# EAGLE design edges_v20 (EAGLE 7.7.0)

## Sheet 1 of 3
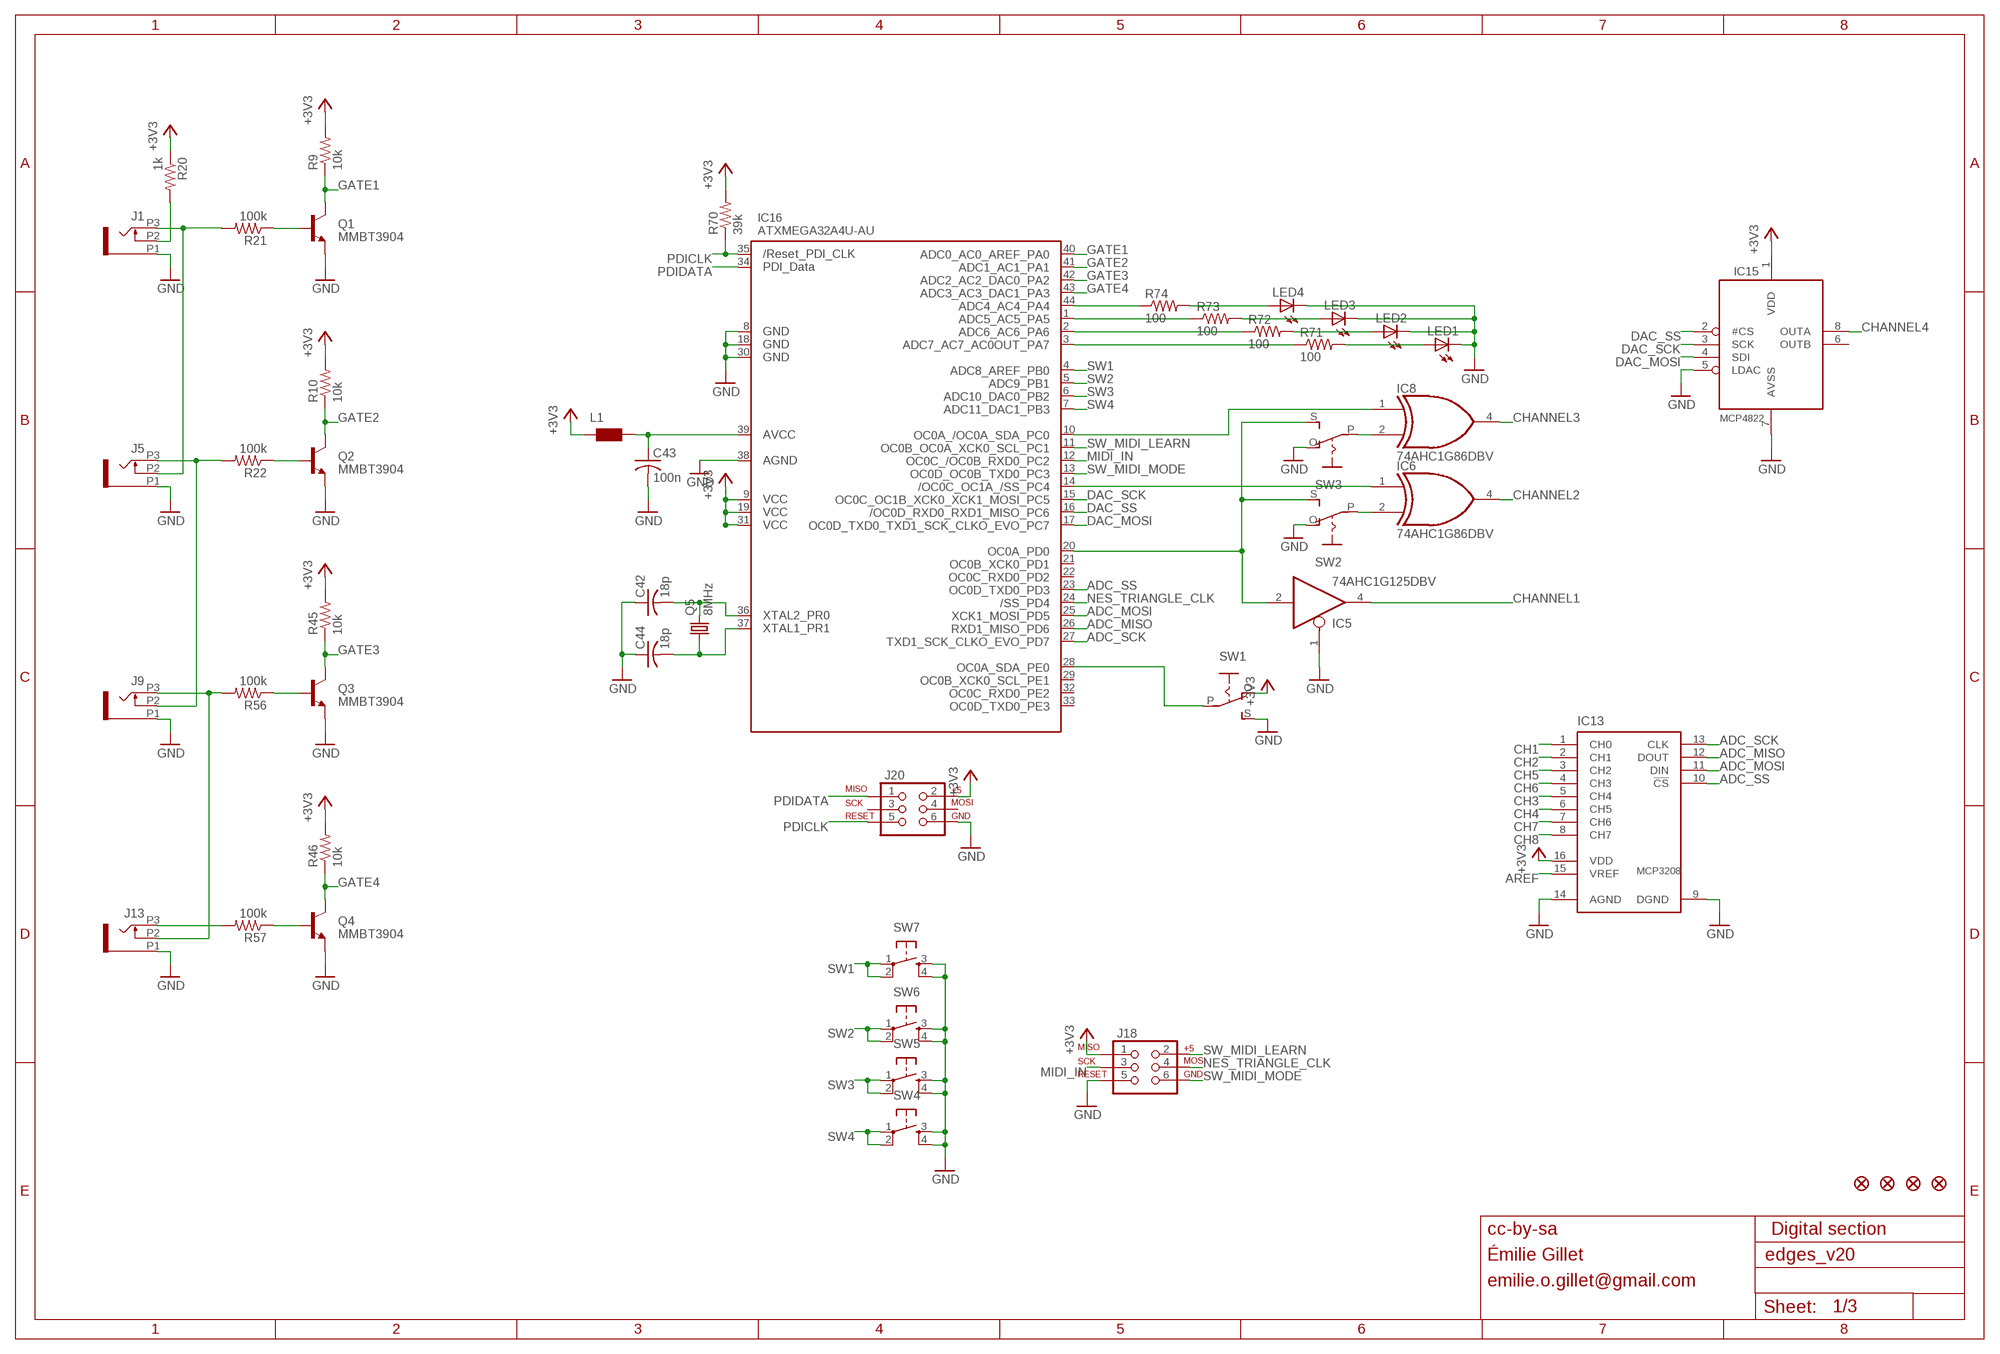
[diagram p0: schematic, sheet 1]

### Parts
C42  18p  C-USC0603  [C0603]
C43  100n  C-USC0603  [C0603]
C44  18p  C-USC0603  [C0603]
IC5  74AHC1G125DBV  [SOT23-5]
IC6  74AHC1G86DBV  [SOT23-5]
IC8  74AHC1G86DBV  [SOT23-5]
IC13  MCP3208  [SO16]
IC15  MCP4822  MCP4822SO08  [SO08]
IC16  ATXMEGA32A4U-AU  AVR_XMEGA_A4_44A  [TQFP44]
J1  PJ301_THONKICONN6  [WQP_PJ_301M6]
J5  PJ301_THONKICONN6  [WQP_PJ_301M6]
J9  PJ301_THONKICONN6  [WQP_PJ_301M6]
J13  PJ301_THONKICONN6  [WQP_PJ_301M6]
J18  AVR_SPI_PRG_6PTH  [2X3]
J20  AVR_SPI_PRG_6PTH  [2X3]
JP1  FIDUCIAL1X2  [FIDUCIAL-1X2]
JP2  FIDUCIAL1X2  [FIDUCIAL-1X2]
JP3  FIDUCIAL1X2  [FIDUCIAL-1X2]
JP4  FIDUCIAL1X2  [FIDUCIAL-1X2]
L1  WE-CBF_0603  [0603]
LED1  LED3MM  [LED3MM]
LED2  LED3MM  [LED3MM]
LED3  LED3MM  [LED3MM]
LED4  LED3MM  [LED3MM]
Q1  MMBT3904  MMBT3904LT1-NPN-SOT23-BEC  [SOT23-BEC]
Q2  MMBT3904  MMBT3904LT1-NPN-SOT23-BEC  [SOT23-BEC]
Q3  MMBT3904  MMBT3904LT1-NPN-SOT23-BEC  [SOT23-BEC]
Q4  MMBT3904  MMBT3904LT1-NPN-SOT23-BEC  [SOT23-BEC]
Q5  8MHz  CRYSTALHC49U70  [HC49U70]
R9  10k  R-US_R0603  [R0603]
R10  10k  R-US_R0603  [R0603]
R20  1k  R-US_R0603  [R0603]
R21  100k  R-US_R0603  [R0603]
R22  100k  R-US_R0603  [R0603]
R45  10k  R-US_R0603  [R0603]
R46  10k  R-US_R0603  [R0603]
R56  100k  R-US_R0603  [R0603]
R57  100k  R-US_R0603  [R0603]
R70  39k  R-US_R0603  [R0603]
R71  100  R-US_R0603  [R0603]
R72  100  R-US_R0603  [R0603]
R73  100  R-US_R0603  [R0603]
R74  100  R-US_R0603  [R0603]
SW1  S-ON-ONSMALL_SLIDE  [ES_100SP1T6B11M2QEH_SMALL]
SW2  S-ON-ONSMALL_SLIDE  [ES_100SP1T6B11M2QEH_SMALL]
SW3  S-ON-ONSMALL_SLIDE  [ES_100SP1T6B11M2QEH_SMALL]
SW4  TAC_SWITCHPTH  [TACTILE-PTH]
SW5  TAC_SWITCHPTH  [TACTILE-PTH]
SW6  TAC_SWITCHPTH  [TACTILE-PTH]
SW7  TAC_SWITCHPTH  [TACTILE-PTH]

### Nets
+3V3: IC13.16(VDD) IC15.1(VDD) IC16.9(VCC1) IC16.19(VCC2) IC16.31(VCC3) J18.1 J20.2 L1.1 R9.2 R10.2 R20.1 R45.2 R46.2 R70.2 SW1.O ; also sheet 3
ADC_MISO: IC13.12(DOUT) IC16.26(PD6)
ADC_MOSI: IC13.11(DIN) IC16.25(PD5)
ADC_SCK: IC13.13(CLK) IC16.27(PD7)
ADC_SS: IC13.10(!CS) IC16.23(PD3)
AREF: IC13.15(VREF) ; also sheet 3
CH1: IC13.1(CH0) ; also sheet 2
CH2: IC13.2(CH1) ; also sheet 2
CH3: IC13.5(CH4) ; also sheet 2
CH4: IC13.6(CH5) ; also sheet 2
CH5: IC13.3(CH2) ; also sheet 2
CH6: IC13.4(CH3) ; also sheet 2
CH7: IC13.7(CH6) ; also sheet 2
CH8: IC13.8(CH7) ; also sheet 2
CHANNEL1: IC5.4(O) ; also sheet 2
CHANNEL2: IC6.4(O) ; also sheet 2
CHANNEL3: IC8.4(O) ; also sheet 2
CHANNEL4: IC15.8(OUTA) ; also sheet 2
DAC_MOSI: IC15.4(SDI) IC16.17(PC7)
DAC_SCK: IC15.3(SCK) IC16.15(PC5)
DAC_SS: IC15.2(#CS) IC16.16(PC6)
GATE1: IC16.40(PA0) Q1.C R9.1
GATE1_IN: J1.P3 J5.P2 R21.2
GATE1_LED: LED4.A R74.2
GATE2: IC16.41(PA1) Q2.C R10.1
GATE2_IN: J5.P3 J9.P2 R22.2
GATE2_LED: LED3.A R73.2
GATE3: IC16.42(PA2) Q3.C R45.1
GATE3_IN: J9.P3 J13.P2 R56.2
GATE3_LED: LED2.A R72.2
GATE4: IC16.43(PA3) Q4.C R46.1
GATE4_IN: J13.P3 R57.2
GATE4_LED: LED1.A R71.2
GND: C42.1 C43.2 C44.1 IC5.1(OE) IC13.9(DGND) IC13.14(AGND) IC15.5(LDAC) IC15.7(AVSS) IC16.8(GND1) IC16.18(GND2) IC16.30(GND3) IC16.38(AGND) J1.P1 J5.P1 J9.P1 J13.P1 J18.5 J20.6 LED1.K(C) LED2.K(C) LED3.K(C) LED4.K(C) Q1.E Q2.E Q3.E Q4.E SW1.S SW2.O SW3.O SW4.3 SW4.4 SW5.3 SW5.4 SW6.3 SW6.4 SW7.3 SW7.4 ; also sheet 2,3
MIDI_IN: IC16.12(PC2) J18.3
N$1: Q1.B R21.1
N$2: Q2.B R22.1
N$3: Q3.B R56.1
N$5: IC16.44(PA4) R74.1
N$6: IC16.1(PA5) R73.1
N$7: IC16.2(PA6) R72.1
N$8: IC16.3(PA7) R71.1
N$12: J1.P2 R20.2
N$19: IC6.1(I0) IC16.14(PC4)
N$21: IC8.2(I1) SW3.P
N$24: IC6.2(I1) SW2.P
N$39: C43.1 IC16.39(AVCC) L1.2
N$41: IC8.1(I0) IC16.10(PC0)
N$48: IC5.2(I) IC16.20(PD0) SW2.S SW3.S
N$82: C44.2 IC16.37(PR1) Q5.1
N$83: C42.2 IC16.36(PR0) Q5.2
N$40000: Q4.B R57.1
NES_TRIANGLE_CLK: IC16.24(PD4) J18.4
PDICLK: IC16.35(RESET) J20.5 R70.1
PDIDATA: IC16.34(PDI_DATA) J20.1
SW1: IC16.4(PB0) SW7.1 SW7.2
SW2: IC16.5(PB1) SW6.1 SW6.2
SW3: IC16.6(PB2) SW5.1 SW5.2
SW4: IC16.7(PB3) SW4.1 SW4.2
SW_MIDI_LEARN: IC16.11(PC1) J18.2
SW_MIDI_MODE: IC16.13(PC3) J18.6
SYNC_SWITCH: IC16.28(PE0) SW1.P
Unconnected: IC15.6(OUTB) IC16.21(PD1) IC16.22(PD2) IC16.29(PE1) IC16.32(PE2) IC16.33(PE3) J20.3 J20.4

### Notes on the sheet
- cc-by-sa | Digital section
- Émilie Gillet
- emilie.o.gillet@gmail.com

## Sheet 2 of 3
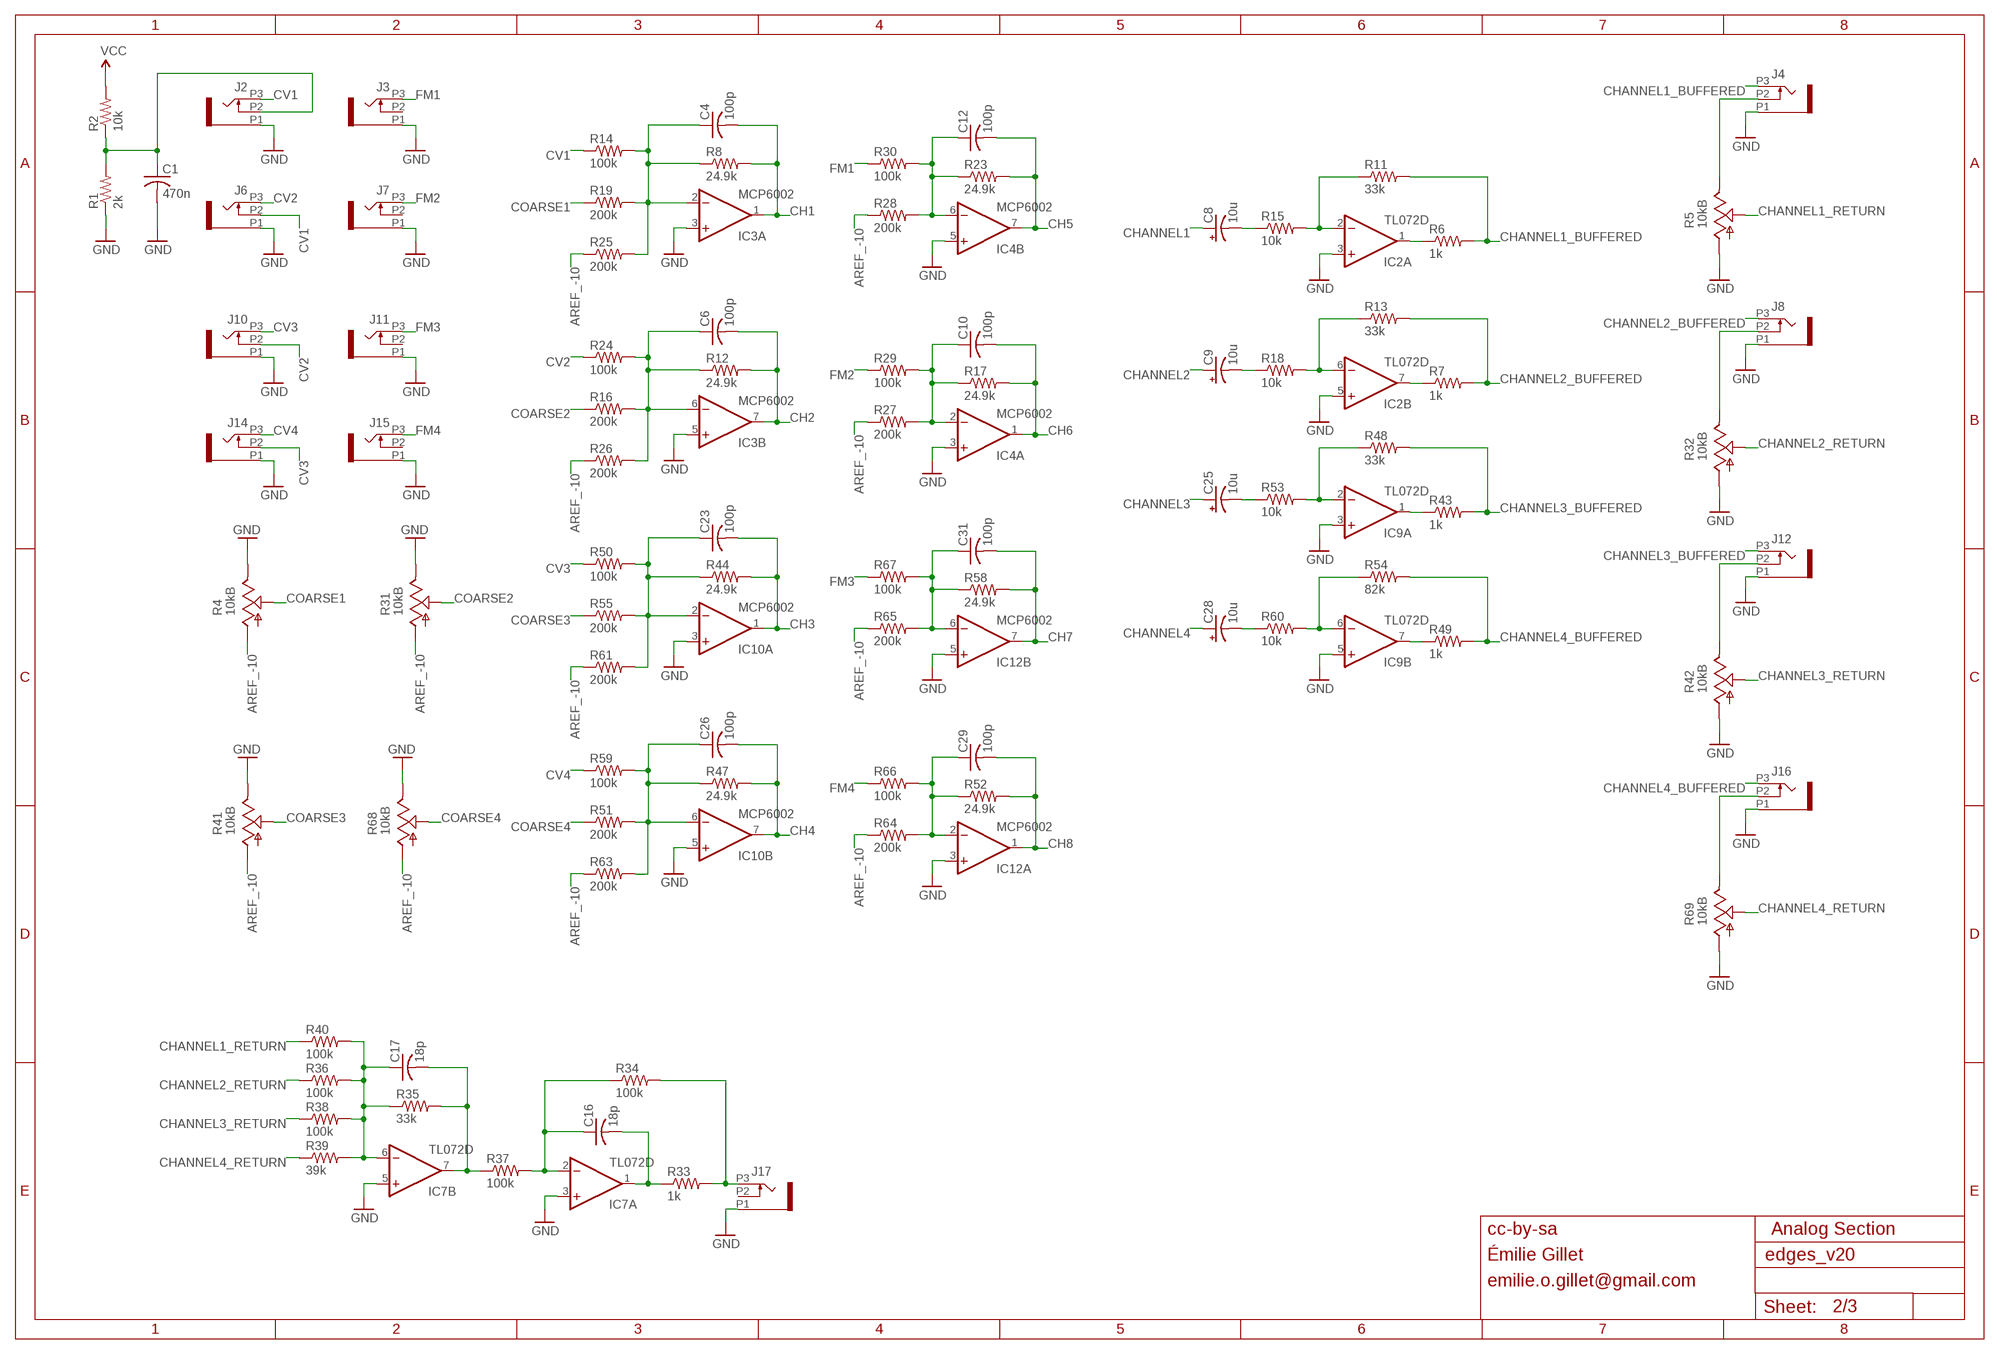
[diagram p1: schematic, sheet 2]

### Parts
C1  470n  C-USC0603  [C0603]
C4  100p  C-USC0603  [C0603]
C6  100p  C-USC0603  [C0603]
C8  10u  CPOL-USB  [PANASONIC_B]
C9  10u  CPOL-USB  [PANASONIC_B]
C10  100p  C-USC0603  [C0603]
C12  100p  C-USC0603  [C0603]
C16  18p  C-USC0603  [C0603]
C17  18p  C-USC0603  [C0603]
C23  100p  C-USC0603  [C0603]
C25  10u  CPOL-USB  [PANASONIC_B]
C26  100p  C-USC0603  [C0603]
C28  10u  CPOL-USB  [PANASONIC_B]
C29  100p  C-USC0603  [C0603]
C31  100p  C-USC0603  [C0603]
IC2  TL072D  [SO08]
IC3  MCP6002  TL072D  [SO08]
IC4  MCP6002  TL072D  [SO08]
IC7  TL072D  [SO08]
IC9  TL072D  [SO08]
IC10  MCP6002  TL072D  [SO08]
IC12  MCP6002  TL072D  [SO08]
J2  PJ301_THONKICONN6  [WQP_PJ_301M6]
J3  PJ301_THONKICONN6  [WQP_PJ_301M6]
J4  PJ301_THONKICONN6  [WQP_PJ_301M6]
J6  PJ301_THONKICONN6  [WQP_PJ_301M6]
J7  PJ301_THONKICONN6  [WQP_PJ_301M6]
J8  PJ301_THONKICONN6  [WQP_PJ_301M6]
J10  PJ301_THONKICONN6  [WQP_PJ_301M6]
J11  PJ301_THONKICONN6  [WQP_PJ_301M6]
J12  PJ301_THONKICONN6  [WQP_PJ_301M6]
J14  PJ301_THONKICONN6  [WQP_PJ_301M6]
J15  PJ301_THONKICONN6  [WQP_PJ_301M6]
J16  PJ301_THONKICONN6  [WQP_PJ_301M6]
J17  PJ301_THONKICONN6  [WQP_PJ_301M6]
R1  2k  R-US_R0603  [R0603]
R2  10k  R-US_R0603  [R0603]
R4  10kB  POT_USVERTICAL_PS  [ALPS_POT_VERTICAL_PS]
R5  10kB  POT_USVERTICAL_PS  [ALPS_POT_VERTICAL_PS]
R6  1k  R-US_R0603  [R0603]
R7  1k  R-US_R0603  [R0603]
R8  24.9k  R-US_R0603  [R0603]
R11  33k  R-US_R0603  [R0603]
R12  24.9k  R-US_R0603  [R0603]
R13  33k  R-US_R0603  [R0603]
R14  100k  R-US_R0603  [R0603]
R15  10k  R-US_R0603  [R0603]
R16  200k  R-US_R0603  [R0603]
R17  24.9k  R-US_R0603  [R0603]
R18  10k  R-US_R0603  [R0603]
R19  200k  R-US_R0603  [R0603]
R23  24.9k  R-US_R0603  [R0603]
R24  100k  R-US_R0603  [R0603]
R25  200k  R-US_R0603  [R0603]
R26  200k  R-US_R0603  [R0603]
R27  200k  R-US_R0603  [R0603]
R28  200k  R-US_R0603  [R0603]
R29  100k  R-US_R0603  [R0603]
R30  100k  R-US_R0603  [R0603]
R31  10kB  POT_USVERTICAL_PS  [ALPS_POT_VERTICAL_PS]
R32  10kB  POT_USVERTICAL_PS  [ALPS_POT_VERTICAL_PS]
R33  1k  R-US_R0603  [R0603]
R34  100k  R-US_R0603  [R0603]
R35  33k  R-US_R0603  [R0603]
R36  100k  R-US_R0603  [R0603]
R37  100k  R-US_R0603  [R0603]
R38  100k  R-US_R0603  [R0603]
R39  39k  R-US_R0603  [R0603]
R40  100k  R-US_R0603  [R0603]
R41  10kB  POT_USVERTICAL_PS  [ALPS_POT_VERTICAL_PS]
R42  10kB  POT_USVERTICAL_PS  [ALPS_POT_VERTICAL_PS]
R43  1k  R-US_R0603  [R0603]
R44  24.9k  R-US_R0603  [R0603]
R47  24.9k  R-US_R0603  [R0603]
R48  33k  R-US_R0603  [R0603]
R49  1k  R-US_R0603  [R0603]
R50  100k  R-US_R0603  [R0603]
R51  200k  R-US_R0603  [R0603]
R52  24.9k  R-US_R0603  [R0603]
R53  10k  R-US_R0603  [R0603]
R54  82k  R-US_R0603  [R0603]
R55  200k  R-US_R0603  [R0603]
R58  24.9k  R-US_R0603  [R0603]
R59  100k  R-US_R0603  [R0603]
R60  10k  R-US_R0603  [R0603]
R61  200k  R-US_R0603  [R0603]
R63  200k  R-US_R0603  [R0603]
R64  200k  R-US_R0603  [R0603]
R65  200k  R-US_R0603  [R0603]
R66  100k  R-US_R0603  [R0603]
R67  100k  R-US_R0603  [R0603]
R68  10kB  POT_USVERTICAL_PS  [ALPS_POT_VERTICAL_PS]
R69  10kB  POT_USVERTICAL_PS  [ALPS_POT_VERTICAL_PS]

### Nets
AREF_-10: R4.P$3(A) R25.1 R26.1 R27.1 R28.1 R31.P$3(A) R41.P$3(A) R61.1 R63.1 R64.1 R65.1 R68.P$3(A) ; also sheet 3
CH1: C4.2 IC3.1(A:OUT) R8.2 ; also sheet 1
CH2: C6.2 IC3.7(B:OUT) R12.2 ; also sheet 1
CH3: C23.2 IC10.1(A:OUT) R44.2 ; also sheet 1
CH4: C26.2 IC10.7(B:OUT) R47.2 ; also sheet 1
CH5: C12.2 IC4.7(B:OUT) R23.2 ; also sheet 1
CH6: C10.2 IC4.1(A:OUT) R17.2 ; also sheet 1
CH7: C31.2 IC12.7(B:OUT) R58.2 ; also sheet 1
CH8: C29.2 IC12.1(A:OUT) R52.2 ; also sheet 1
CHANNEL1: C8.+ ; also sheet 1
CHANNEL1_BUFFERED: J4.P3 R6.2 R11.2
CHANNEL1_RETURN: R5.P$2(S) R40.1
CHANNEL2: C9.+ ; also sheet 1
CHANNEL2_BUFFERED: J8.P3 R7.2 R13.2
CHANNEL2_RETURN: R32.P$2(S) R36.1
CHANNEL3: C25.+ ; also sheet 1
CHANNEL3_BUFFERED: J12.P3 R43.2 R48.2
CHANNEL3_RETURN: R38.1 R42.P$2(S)
CHANNEL4: C28.+ ; also sheet 1
CHANNEL4_BUFFERED: J16.P3 R49.2 R54.2
CHANNEL4_RETURN: R39.1 R69.P$2(S)
COARSE1: R4.P$2(S) R19.1
COARSE2: R16.1 R31.P$2(S)
COARSE3: R41.P$2(S) R55.1
COARSE4: R51.1 R68.P$2(S)
CV1: J2.P3 J6.P2 R14.1
CV2: J6.P3 J10.P2 R24.1
CV3: J10.P3 J14.P2 R50.1
CV4: J14.P3 R59.1
FM1: J3.P3 R30.1
FM2: J7.P3 R29.1
FM3: J11.P3 R67.1
FM4: J15.P3 R66.1
GND: C1.2 IC2.3(A:+IN) IC2.5(B:+IN) IC3.3(A:+IN) IC3.5(B:+IN) IC4.3(A:+IN) IC4.5(B:+IN) IC7.3(A:+IN) IC7.5(B:+IN) IC9.3(A:+IN) IC9.5(B:+IN) IC10.3(A:+IN) IC10.5(B:+IN) IC12.3(A:+IN) IC12.5(B:+IN) J2.P1 J3.P1 J4.P1 J6.P1 J7.P1 J8.P1 J10.P1 J11.P1 J12.P1 J14.P1 J15.P1 J16.P1 J17.P1 R1.1 R4.P$1(E) R5.P$3(A) R31.P$1(E) R32.P$3(A) R41.P$1(E) R42.P$3(A) R68.P$1(E) R69.P$3(A) ; also sheet 1,3
MIX: J17.P3 R33.2 R34.2
N$4: J8.P2 R32.P$1(E)
N$9: C23.1 IC10.2(A:-IN) R44.1 R50.2 R55.2 R61.2
N$11: C10.1 IC4.2(A:-IN) R17.1 R27.2 R29.2
N$13: C26.1 IC10.6(B:-IN) R47.1 R51.2 R59.2 R63.2
N$15: C31.1 IC12.6(B:-IN) R58.1 R65.2 R67.2
N$18: C29.1 IC12.2(A:-IN) R52.1 R64.2 R66.2
N$20: C8.- R15.1
N$22: IC2.2(A:-IN) R11.1 R15.2
N$23: IC2.1(A:OUT) R6.1
N$25: C9.- R18.1
N$26: IC2.6(B:-IN) R13.1 R18.2
N$27: IC2.7(B:OUT) R7.1
N$28: C25.- R53.1
N$29: C12.1 IC4.6(B:-IN) R23.1 R28.2 R30.2
N$30: IC9.2(A:-IN) R48.1 R53.2
N$31: IC9.1(A:OUT) R43.1
N$32: C28.- R60.1
N$33: IC9.6(B:-IN) R54.1 R60.2
N$34: IC9.7(B:OUT) R49.1
N$35: C17.1 IC7.6(B:-IN) R35.1 R36.2 R38.2 R39.2 R40.2
N$36: C16.1 IC7.2(A:-IN) R34.1 R37.2
N$37: C16.2 IC7.1(A:OUT) R33.1
N$40: J4.P2 R5.P$1(E)
N$42: C17.2 IC7.7(B:OUT) R35.2 R37.1
N$43: J12.P2 R42.P$1(E)
N$44: J16.P2 R69.P$1(E)
N$45: C6.1 IC3.6(B:-IN) R12.1 R16.2 R24.2 R26.2
N$46: C1.1 J2.P2 R1.2 R2.1
N$50: C4.1 IC3.2(A:-IN) R8.1 R14.2 R19.2 R25.2
VCC: R2.2 ; also sheet 3
Unconnected: J3.P2 J7.P2 J11.P2 J15.P2 J17.P2

### Notes on the sheet
- cc-by-sa | Analog Section
- Émilie Gillet
- emilie.o.gillet@gmail.com

## Sheet 3 of 3
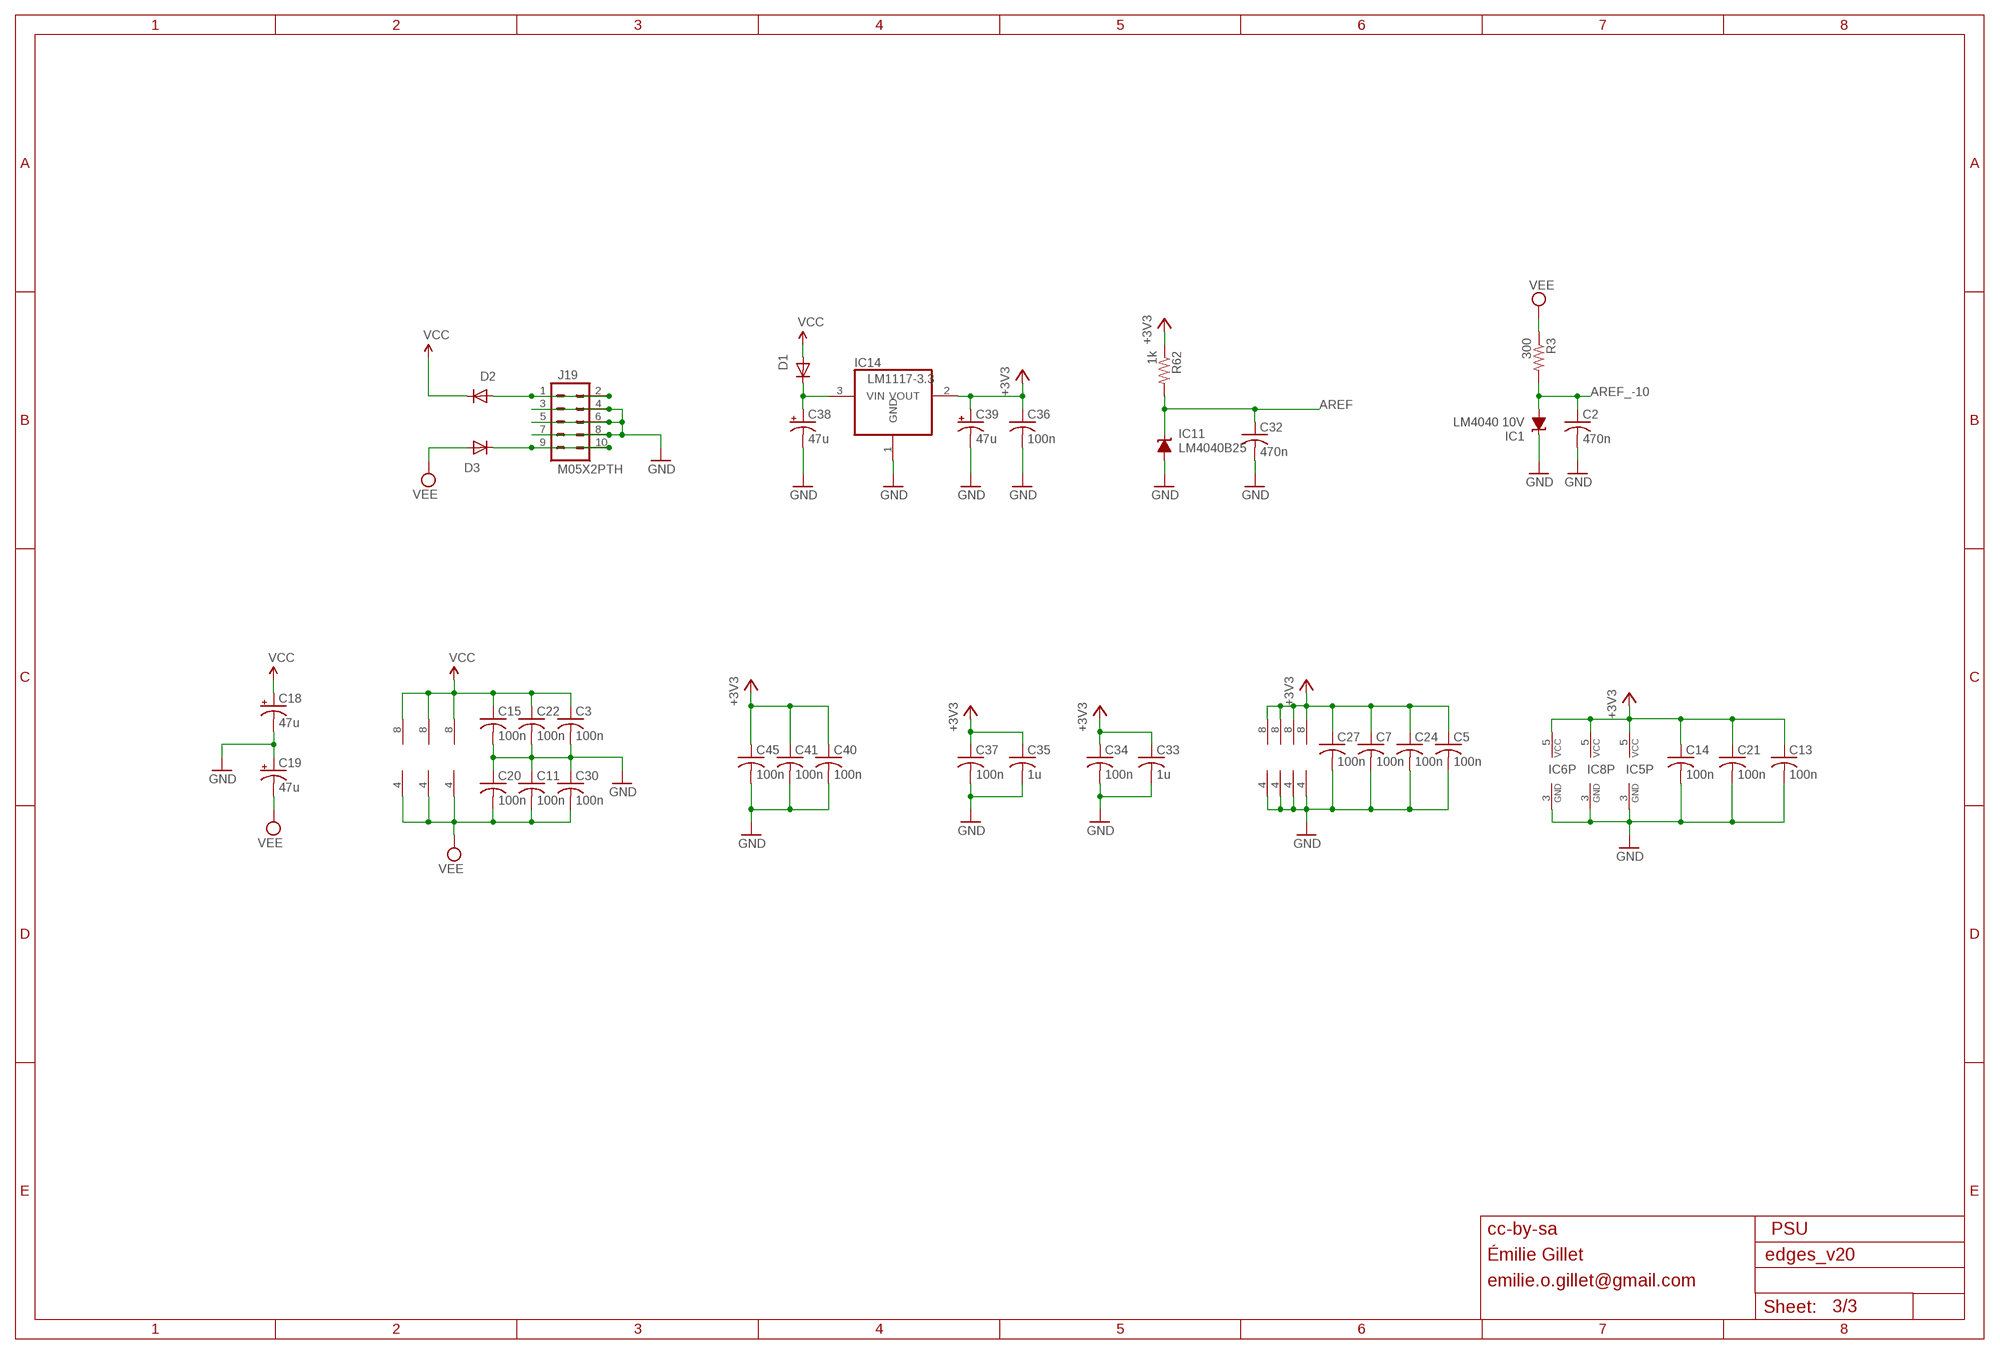
[diagram p2: schematic, sheet 3]

### Parts
C2  470n  C-USC0603  [C0603]
C3  100n  C-USC0603  [C0603]
C5  100n  C-USC0603  [C0603]
C7  100n  C-USC0603  [C0603]
C11  100n  C-USC0603  [C0603]
C13  100n  C-USC0603  [C0603]
C14  100n  C-USC0603  [C0603]
C15  100n  C-USC0603  [C0603]
C18  47u  CPOL-USD  [PANASONIC_D]
C19  47u  CPOL-USD  [PANASONIC_D]
C20  100n  C-USC0603  [C0603]
C21  100n  C-USC0603  [C0603]
C22  100n  C-USC0603  [C0603]
C24  100n  C-USC0603  [C0603]
C27  100n  C-USC0603  [C0603]
C30  100n  C-USC0603  [C0603]
C32  470n  C-USC0603  [C0603]
C33  1u  C-USC0603  [C0603]
C34  100n  C-USC0603  [C0603]
C35  1u  C-USC0603  [C0603]
C36  100n  C-USC0603  [C0603]
C37  100n  C-USC0603  [C0603]
C38  47u  CPOL-USD  [PANASONIC_D]
C39  47u  CPOL-USD  [PANASONIC_D]
C40  100n  C-USC0603  [C0603]
C41  100n  C-USC0603  [C0603]
C45  100n  C-USC0603  [C0603]
D1  1N5819HW  DIODE-SOD123  [SOD123]
D2  1N5819HW  DIODE-SOD123  [SOD123]
D3  1N5819HW  DIODE-SOD123  [SOD123]
IC1  LM4040 10V  LM4041C12DBZ  [DBZ_R-PDSO-G3]
IC11  LM4040B25  LM4041B12DBZ  [DBZ_R-PDSO-G3]
IC14  LM1117-3.3  REG1117  [SOT223]
J19  M05X2PTH  [AVR_ICSP]
R3  300  R-US_R0603  [R0603]
R62  1k  R-US_R0603  [R0603]

### Nets
+3V3: C5.1 C7.1 C13.1 C14.1 C21.1 C24.1 C27.1 C33.1 C34.1 C35.1 C36.1 C37.1 C39.+ C40.1 C41.1 C45.1 IC3.8(P:V+) IC4.8(P:V+) IC5.5(VCC) IC6.5(VCC) IC8.5(VCC) IC10.8(P:V+) IC12.8(P:V+) IC14.2(VOUT) R62.1 ; also sheet 1
AREF: C32.1 IC11.1(C) R62.2 ; also sheet 1
AREF_-10: C2.1 IC1.2(A) R3.2 ; also sheet 2
GND: C2.2 C3.2 C5.2 C7.2 C11.1 C13.2 C14.2 C15.2 C18.- C19.+ C20.1 C21.2 C22.2 C24.2 C27.2 C30.1 C32.2 C33.2 C34.2 C35.2 C36.2 C37.2 C38.- C39.- C40.2 C41.2 C45.2 IC1.1(C) IC3.4(P:V-) IC4.4(P:V-) IC5.3(GND) IC6.3(GND) IC8.3(GND) IC10.4(P:V-) IC11.2(A) IC12.4(P:V-) IC14.1(GND) J19.3 J19.4 J19.5 J19.6 J19.7 J19.8 ; also sheet 1,2
N$38: C38.+ D1.C IC14.3(VIN)
N$47: D2.A J19.1 J19.2
N$49: D3.C J19.9 J19.10
VCC: C3.1 C15.1 C18.+ C22.1 D1.A D2.C IC2.8(P:V+) IC7.8(P:V+) IC9.8(P:V+) ; also sheet 2
VEE: C11.2 C19.- C20.2 C30.2 D3.A IC2.4(P:V-) IC7.4(P:V-) IC9.4(P:V-) R3.1

### Notes on the sheet
- cc-by-sa | PSU
- Émilie Gillet
- emilie.o.gillet@gmail.com

## Library data of the parts
C1-C7 C10-C17 C20-C24 C26 C27 C29-C37 C40-C45 = rcl:C-US: CAPACITOR, American symbol
C8 C9 C18 C19 C25 C28 C38 C39 = rcl:CPOL-US: POLARIZED CAPACITOR, American symbol
D1-D3 = diode:DIODE-: DIODE
IC1 IC11 = texas:LM4041: PRECISION MICROPOWER SHUNT VOLTAGE REFERENCE Source: http://focus.ti.com/lit/ds/slcs146e/slcs146e.pdf
IC2-IC4 IC7 IC9 IC10 IC12 = og-linear:TL072: OP AMP
IC5 = 74xx-little-us:74*1G125: Single Bus Buffer Gate with 3-State Output
IC6 IC8 = 74xx-little-us:74*1G86: 2-input EXCLUSIV-OR gate
IC13 = og-adc:MCP3208
IC14 = og-vreg:REG1117: 800mA and 1A Low Dropout (LDO) Positive Regulator 1.8V, 2.5V, 2.85V, 3.3V, 5V, and Adj
IC15 = og-dac:MCP4822
IC16 = xmega:AVR_XMEGA_A4_: Device for Atmel AVR XMEGA A4 Series
J1-J17 = og-pj301:PJ301_THONKICONN
J18 J20 = SparkFun:AVR_SPI_PRG_6: AVR ISP 6 Pin This is the reduced ISP connector for AVR programming. Common on Arduino. This footprint will take up less PCB space and can be used with a 10-pin to 6-pin adapter such as SKU: BOB-08508
J19 = SparkFun:M05X2: Header 5x2 Standard 10-pin dual row 0.1" header. Commonly used with AVR-ISP. Use with Spark Fun Electronics SKU: PRT-00778
JP1-JP4 = SparkFun:FIDUCIAL: Fiducial Alignment Points Various fiducial points for machine vision alignment.
L1 = wuerth-elektronik:WE-CBF: SMD EMI Suppression Ferrite Beads - excellent anti-EMI properties - low DCR - impedances till 3000 ohms - rated current up to 6 A
LED1-LED4 = led:LED: LED OSRAM: - CHIPLED LG R971, LG N971, LY N971, LG Q971, LY Q971, LO R971, LY R971 LH N974, LH R974 LS Q976, LO Q976, LY Q976 LO Q996 - Hyper CHIPLED LW Q18S LB Q993, LB Q99A, LB R99A - SideLED LS A670, LO A670, LY A670, LG A670, LP A670 LB A673, LV A673, LT A673, LW A673 LH A674 LY A675 LS A676, LA A676, LO A676, LY A676, LW A676 LS A679, LY A679, LG A679 - Hyper Micro SIDELED® LS Y876, LA Y876, LO Y876, LY Y876 LT Y87S - SmartLED LW L88C, LW L88S LB L89C, LB L89S, LG L890 LS L89K, LO L89K, LY L89K LS L896, LA L896, LO L896, LY L896 - TOPLED LS T670, LO T670, LY T670, LG T670, LP T670 LSG T670, LSP T670, LSY T670, LOP T670, LYG T670 LG T671, LOG T671, LSG T671 LB T673, LV T673, LT T673, LW T673 LH T674 LS T676, LA T676, LO T676, LY T676, LB T676, LH T676, LSB T676, LW T676 LB T67C, LV T67C, LT T67C, LS T67K, LO T67K, LY T67K, LW E67C LS E67B, LA E67B, LO E67B, LY E67B, LB E67C, LV E67C, LT E67C LW T67C LS T679, LY T679, LG T679 LS T770, LO T770, LY T770, LG T770, LP T770 LB T773, LV T773, LT T773, LW T773 LH T774 LS E675, LA E675, LY E675, LS T675 LS T776, LA T776, LO T776, LY T776, LB T776 LHGB T686 LT T68C, LB T68C - Hyper Mini TOPLED® LB M676 - Mini TOPLED Santana® LG M470 LS M47K, LO M47K, LY M47K Source: http://www.osram.convergy.de LUXEON: - LUMILED® LXK2-PW12-R00, LXK2-PW12-S00, LXK2-PW14-U00, LXK2-PW14-V00 LXK2-PM12-R00, LXK2-PM12-S00, LXK2-PM14-U00 LXK2-PE12-Q00, LXK2-PE12-R00, LXK2-PE12-S00, LXK2-PE14-T00, LXK2-PE14-U00 LXK2-PB12-K00, LXK2-PB12-L00, LXK2-PB12-M00, LXK2-PB14-N00, LXK2-PB14-P00, LXK2-PB14-Q00 LXK2-PR12-L00, LXK2-PR12-M00, LXK2-PR14-Q00, LXK2-PR14-R00 LXK2-PD12-Q00, LXK2-PD12-R00, LXK2-PD12-S00 LXK2-PH12-R00, LXK2-PH12-S00 LXK2-PL12-P00, LXK2-PL12-Q00, LXK2-PL12-R00 Source: www.luxeon.com KINGBRIGHT: KA-3528ASYC Source: www.kingbright.com
Q1-Q4 = transistor:*-NPN-: NPN Transistror BF959 corrected 2008.03.06
Q5 = crystal:CRYSTAL: CRYSTAL
R1 R2 R6-R30 R33-R40 R43-R67 R70-R74 = rcl:R-US_: RESISTOR, American symbol
R3 = resistor:R-US_: RESISTOR, American symbol
R4 R5 R31 R32 R41 R42 R68 R69 = pot-alps:POT_US
SW1-SW3 = og-switch:S-ON-ON: On-on Switch
SW4-SW7 = SparkFun:TAC_SWITCH: Momentary Switch Button commonly used for reset or general input. Spark Fun Electronics SKU : COM-00097

## Board
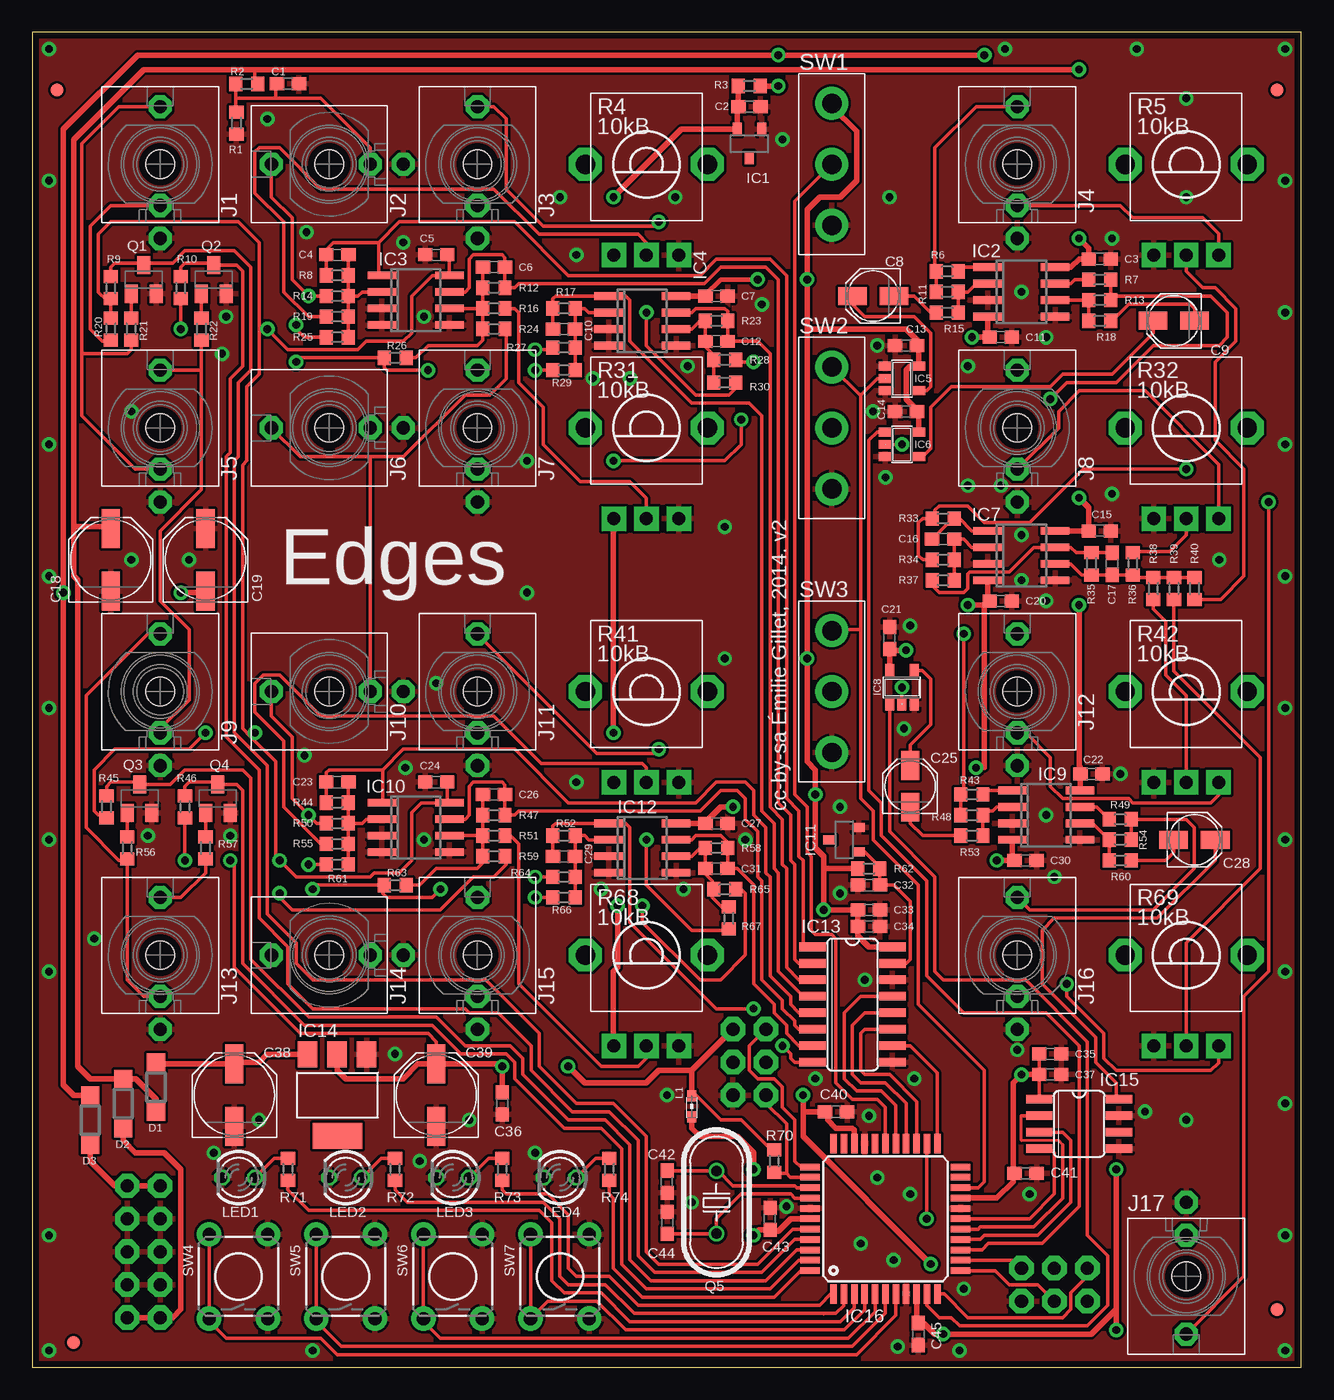
[diagram p3: board, top side]
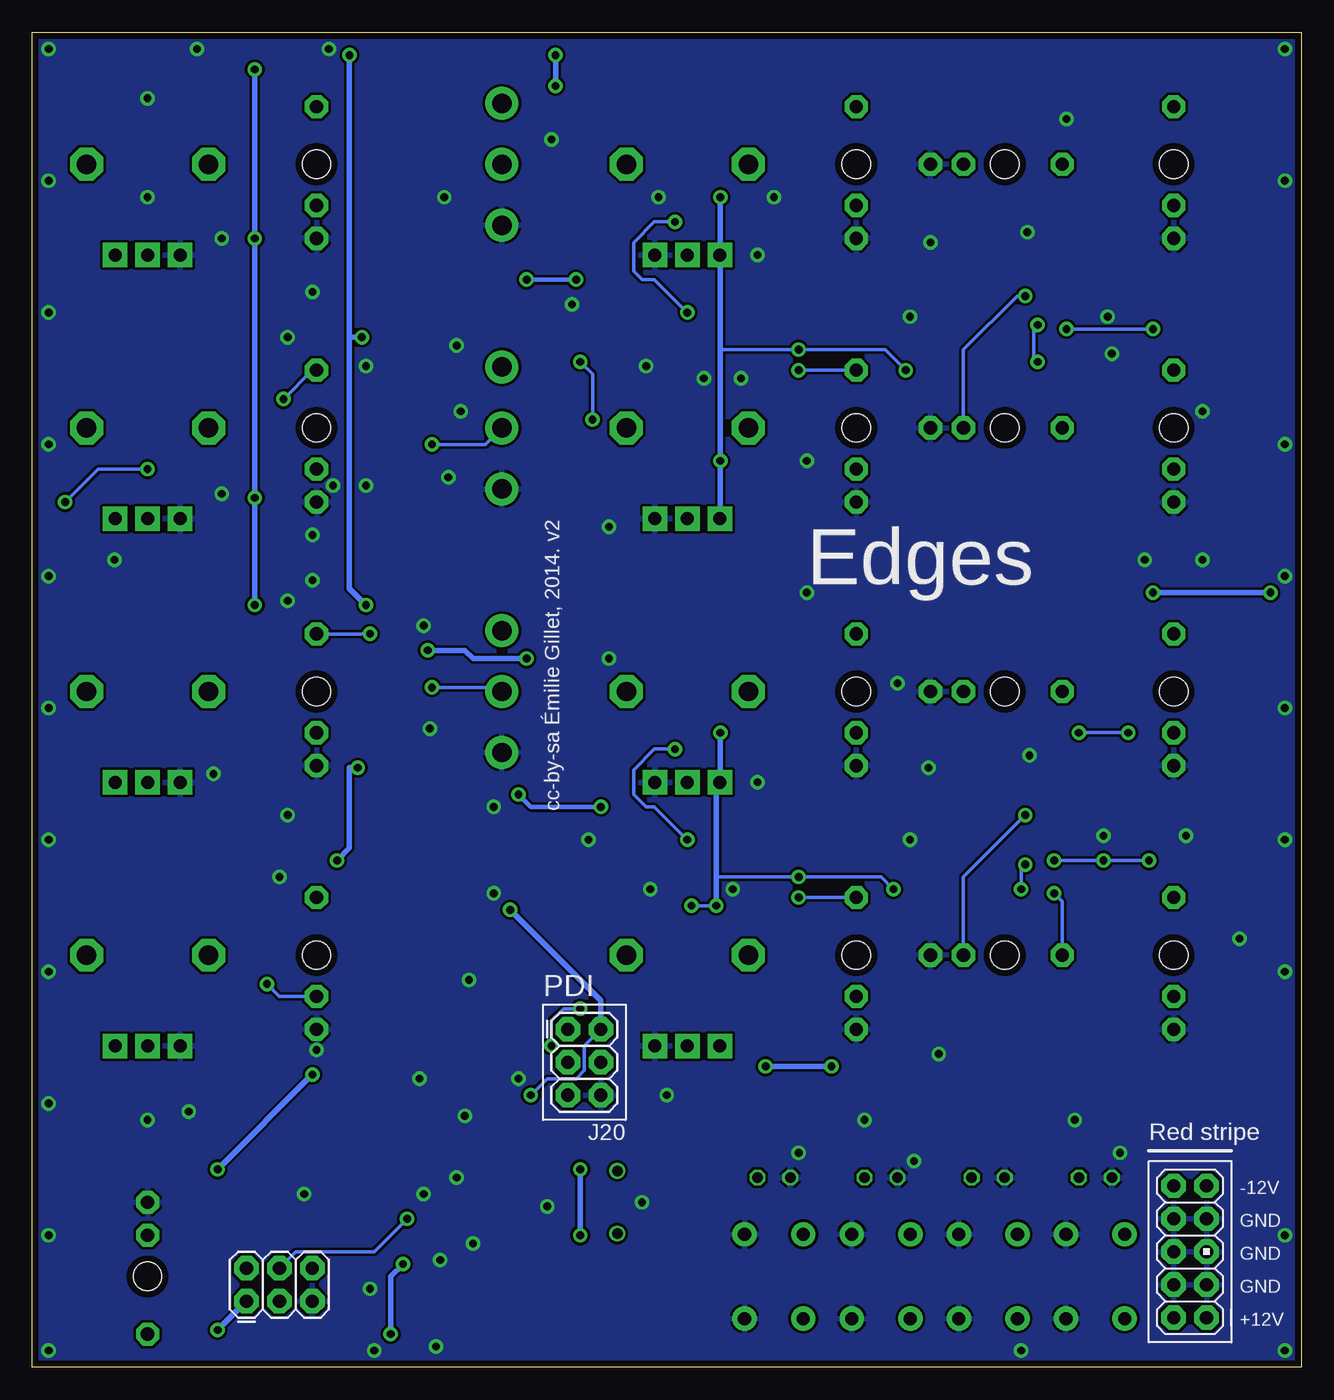
[diagram p4: board, bottom side, seen from below]

Size 97.77 x 102.87 mm. Coordinates in mm from the lower left corner, seen from the top.
Outline: 0,0 97.77,0 97.77,102.87 0,102.87 0,0
Copper layers (1*16): Top 0.035mm / dielectric 1.5mm / Bottom 0.035mm
Design rules "PCBCart-Standard *": minimum track width 8mil, minimum drill 0.4mm, track to track 8mil, track to pad 8mil, pad to pad 8mil, via to via 8mil, smd to smd 8mil, copper to edge 20mil, drill to drill 8mil, minimum pad ring 8mil, minimum via ring 10mil, stop-mask expansion 3mil, vias tented up to drill 25mil, thermal gap 8mil

### Footprints (pad centres in the part's own frame; a part is rotated, then mirrored left to right if it is on the bottom)
C0603 = smd 1.1 x 1: 1 -0.85,0; 2 0.85,0
PANASONIC_B = smd 2.2 x 1.4: + 1.6,0; - -1.6,0
PANASONIC_D = smd 3 x 1.4: + 2.4,0; - -2.4,0
SOD123 = smd 1.4 x 1.4: A 1.9,0; C -1.9,0
DBZ_R-PDSO-G3 = smd 0.7 x 1: 1 -0.95,-1.1; 2 0.95,-1.1; 3 0,1.1
SO08 = smd 0.6 x 2.2: 1 -1.905,-2.6; 2 -0.635,-2.6; 3 0.635,-2.6; 4 1.905,-2.6; 5 1.905,2.6; 6 0.635,2.6; 7 -0.635,2.6; 8 -1.905,2.6
SOT23-5 = smd 0.69 x 0.99: 1 -0.95,-1.29; 2 0,-1.29; 3 0.95,-1.29; 4 0.95,1.3; 5 -0.95,1.3
SO16 = smd 0.66 x 2.032: 1 -4.445,-3.073; 2 -3.175,-3.073; 3 -1.905,-3.073; 4 -0.635,-3.073; 5 0.635,-3.073; 6 1.905,-3.073; 7 3.175,-3.073; 8 4.445,-3.073; 9 4.445,3.073; 10 3.175,3.073; 11 1.905,3.073; 12 0.635,3.073; 13 -0.635,3.073; 14 -1.905,3.073; 15 -3.175,3.073; 16 -4.445,3.073
SOT223 = smd 1.499 x 2.007: 1 -2.261,-3.15; 2 0.025,-3.15; 3 2.311,-3.15 | smd 3.81 x 2.007: 4 0,3.15
SO08' = smd 0.66 x 2.032: 1 -1.905,-3.073; 2 -0.635,-3.073; 3 0.635,-3.073; 4 1.905,-3.073; 5 1.905,3.073; 6 0.635,3.073; 7 -0.635,3.073; 8 -1.905,3.073
TQFP44 = smd 1.5 x 0.5: 1 -5.8,4; 2 -5.8,3.2; 3 -5.8,2.4; 4 -5.8,1.6; 5 -5.8,0.8; 6 -5.8,0; 7 -5.8,-0.8; 8 -5.8,-1.6; 9 -5.8,-2.4; 10 -5.8,-3.2; 11 -5.8,-4; 23 5.8,-4; 24 5.8,-3.2; 25 5.8,-2.4; 26 5.8,-1.6; 27 5.8,-0.8; 28 5.8,0; 29 5.8,0.8; 30 5.8,1.6; 31 5.8,2.4; 32 5.8,3.2; 33 5.8,4 | smd 0.5 x 1.5: 12 -4,-5.8; 13 -3.2,-5.8; 14 -2.4,-5.8; 15 -1.6,-5.8; 16 -0.8,-5.8; 17 0,-5.8; 18 0.8,-5.8; 19 1.6,-5.8; 20 2.4,-5.8; 21 3.2,-5.8; 22 4,-5.8; 34 4,5.8; 35 3.2,5.8; 36 2.4,5.8; 37 1.6,5.8; 38 0.8,5.8; 39 0,5.8; 40 -0.8,5.8; 41 -1.6,5.8; 42 -2.4,5.8; 43 -3.2,5.8; 44 -4,5.8
WQP_PJ_301M6 = drill 1.016 pad 1.778 octagon: P1 0,-5.715; P2 0,-3.175; P3 0,4.445 | hole 2.2: 0,0
2X3 = drill 1.016 pad 1.88 octagon: 1 0,0; 2 0,2.54; 3 2.54,0; 4 2.54,2.54; 5 5.08,0; 6 5.08,2.54
AVR_ICSP = drill 1.016 pad 1.88 octagon: 1 -1.27,5.08; 2 1.27,5.08; 3 -1.27,2.54; 4 1.27,2.54; 5 -1.27,0; 6 1.27,0; 7 -1.27,-2.54; 8 1.27,-2.54; 9 -1.27,-5.08; 10 1.27,-5.08
FIDUCIAL-1X2 = smd 1 x 1: 1 0,0
0603 = smd 0.85 x 0.7: 1 -0.9,0; 2 0.7,0
LED3MM = drill 0.813 octagon: A -1.27,0; K 1.27,0
SOT23-BEC = smd 1 x 1.4: B -0.95,-1.1; C 0,1.1; E 0.95,-1.1
HC49U70 = drill 0.813 round: 1 -2.413,0; 2 2.413,0
R0603 = smd 1 x 1.1: 1 -0.85,0; 2 0.85,0
ALPS_POT_VERTICAL_PS = drill 1 pad 1.88 square: P$1 -2.5,7; P$2 0,7; P$3 2.5,7 | drill 1.5 pad 2.54 octagon: P$4 -4.7,0; P$5 4.7,0
ES_100SP1T6B11M2QEH_SMALL = drill 1.5 pad 2.54 round: O -4.699,0; P 0,0; S 4.699,0
TACTILE-PTH = drill 1.016 pad 1.88 round: 1 -3.251,2.261; 2 3.251,2.261; 3 -3.251,-2.261; 4 3.251,-2.261

### Placement (x,y rotation side)
C1  19.68,98.9 0 top
C2  55.24,97.16 0 top
C3  82.23,85.41 0 top
C4  23.5,85.72 180 top
C5  31.11,85.72 180 top
C6  35.56,84.77 0 top
C7  52.7,82.55 0 top
C8  64.77,82.55 180 top
C9  87.95,80.64 180 top
C10  40.96,80.01 180 top
C11  74.61,79.38 180 top
C12  52.7,79.06 0 top
C13  67.31,78.74 180 top
C14  67.31,73.66 180 top
C15  82.23,64.45 0 top
C16  70.17,63.82 180 top
C17  83.19,61.91 90 top
C18  6.03,62.23 90 top
C19  13.34,62.23 90 top
C20  74.61,59.05 180 top
C21  66.04,56.2 90 top
C22  81.6,45.72 0 top
C23  23.5,45.09 180 top
C24  31.11,45.09 180 top
C25  67.63,44.77 90 top
C26  35.56,44.13 0 top
C27  52.7,41.91 0 top
C28  89.53,40.64 0 top
C29  40.96,39.37 180 top
C30  76.52,39.05 180 top
C31  52.7,38.42 0 top
C32  64.45,37.15 180 top
C33  64.45,35.24 0 top
C34  64.45,33.97 0 top
C35  78.42,24.13 0 top
C36  36.2,20.32 270 top
C37  78.42,22.54 0 top
C38  15.56,20.95 90 top
C39  31.11,20.95 90 top
C40  61.91,19.68 0 top
C41  76.52,14.92 0 top
C42  48.9,14.29 90 top
C43  56.83,11.43 90 top
C44  48.9,11.11 270 top
C45  68.26,2.54 270 top
D1  9.53,21.59 270 top
D2  6.99,20.32 270 top
D3  4.45,19.05 90 top
IC1  55.24,94.3 180 top
IC2  76.2,82.87 270 top
IC3  29.53,82.23 270 top
IC4  46.99,80.64 270 top
IC5  66.99,76.2 270 top
IC6  66.99,71.12 270 top
IC7  76.2,62.55 270 top
IC8  66.99,52.39 0 top
IC9  78.11,42.55 270 top
IC10  29.53,41.59 270 top
IC11  62.55,40.64 90 top
IC12  46.99,40.01 270 top
IC13  63.18,27.94 270 top
IC14  23.5,20.95 180 top
IC15  MCP4822  [SO08']  80.64,18.73 270 top
IC16  65.72,11.43 90 top
J1  9.84,92.71 0 top
J2  22.86,92.71 90 top
J3  34.29,92.71 0 top
J4  75.88,92.71 0 top
J5  9.84,72.39 0 top
J6  22.86,72.39 90 top
J7  34.29,72.39 0 top
J8  75.88,72.39 0 top
J9  9.84,52.07 0 top
J10  22.86,52.07 90 top
J11  34.29,52.07 0 top
J12  75.88,52.07 0 top
J13  9.84,31.75 0 top
J14  22.86,31.75 90 top
J15  34.29,31.75 0 top
J16  75.88,31.75 0 top
J17  88.9,6.99 180 top
J18  81.28,5.08 0 bottom
J19  8.57,8.89 180 bottom
J20  56.52,26.04 270 bottom
JP1  1.91,98.42 0 top
JP2  95.89,98.42 0 top
JP3  95.89,4.45 0 top
JP4  3.17,1.91 0 top
L1  50.8,20 270 top
LED1  15.88,14.61 180 top
LED2  24.13,14.61 180 top
LED3  32.38,14.61 180 top
LED4  40.64,14.61 180 top
Q1  8.57,83.82 0 top
Q2  13.97,83.82 0 top
Q3  8.26,43.81 0 top
Q4  14.29,43.81 0 top
Q5  52.7,12.7 90 top
R1  15.72,95.89 90 top
R2  16.51,98.9 0 top
R3  55.24,98.74 180 top
R4  47.31,92.71 180 top
R5  88.9,92.71 180 top
R6  70.48,84.45 180 top
R7  82.23,83.82 0 top
R8  23.5,84.14 180 top
R9  6.03,83.19 270 top
R10  11.43,83.19 270 top
R11  70.48,82.87 180 top
R12  35.56,83.19 0 top
R13  82.23,82.23 0 top
R14  23.5,82.55 0 top
R15  70.48,81.28 0 top
R16  35.56,81.6 180 top
R17  40.96,81.6 180 top
R18  82.23,80.64 180 top
R19  23.5,80.96 0 top
R20  6.03,80.01 270 top
R21  7.62,80.01 270 top
R22  13.02,80.01 270 top
R23  52.7,80.64 0 top
R24  35.56,80.01 180 top
R25  23.5,79.38 0 top
R26  27.94,77.79 0 top
R27  40.96,78.58 0 top
R28  53.34,77.63 180 top
R29  40.96,76.83 0 top
R30  53.34,75.88 180 top
R31  47.31,72.39 180 top
R32  88.9,72.39 180 top
R33  70.17,65.41 180 top
R34  70.17,62.23 180 top
R35  81.6,61.91 90 top
R36  84.77,61.91 270 top
R37  70.17,60.64 0 top
R38  86.36,60.01 90 top
R39  87.95,60.01 90 top
R40  89.53,60.01 90 top
R41  47.31,52.07 180 top
R42  88.9,52.07 180 top
R43  72.39,44.13 180 top
R44  23.5,43.5 180 top
R45  5.71,43.18 270 top
R46  11.75,43.18 270 top
R47  35.56,42.55 0 top
R48  72.39,42.55 180 top
R49  83.82,42.23 0 top
R50  23.5,41.91 0 top
R51  35.56,40.96 180 top
R52  40.96,40.96 180 top
R53  72.39,40.96 0 top
R54  83.82,40.64 0 top
R55  23.5,40.32 0 top
R56  7.3,40.01 270 top
R57  13.34,40.01 270 top
R58  52.7,40.01 0 top
R59  35.56,39.37 180 top
R60  83.82,39.05 180 top
R61  23.5,38.73 0 top
R62  64.45,38.42 0 top
R63  27.94,37.15 0 top
R64  40.96,37.78 0 top
R65  53.34,36.83 180 top
R66  40.96,36.2 0 top
R67  53.66,34.61 90 top
R68  47.31,31.75 180 top
R69  88.9,31.75 180 top
R70  57.15,15.88 90 top
R71  19.68,15.24 90 top
R72  27.94,15.24 90 top
R73  36.2,15.24 90 top
R74  44.45,15.24 90 top
SW1  61.59,92.71 270 top
SW2  61.59,72.39 90 top
SW3  61.59,52.07 90 top
SW4  15.88,6.99 90 top
SW5  24.13,6.99 90 top
SW6  32.38,6.99 90 top
SW7  40.64,6.99 90 top

### Tracks (layer width: path | path; a pad name or v marks a point on that pad's centre or on a via)
+3V3  (via drill 0.6)
  Top 0.254: C35.1 C37.1 IC15.1 | 16.83,48.58 18.73,46.67 18.73,39.37 v19.05,39.05 20.32,37.78 26.04,37.78 26.35,38.1 28.26,38.1 29.21,39.05 29.21,42.76 29.95,43.5 IC10.8 31.96,43.66 C24.1 | 16.83,48.58 16.19,49.21 16.19,69.53 16.51,69.85 16.51,75.56 17.46,76.52 17.46,80.01 | 50.8,21.27 53.02,19.05 54.61,19.05 56.94,16.73 R70.2 | 5.93,82.23 R9.2 | 5.93,82.23 5.71,82.23 5.08,82.87 5.08,87.31 6.03,88.27 15.88,88.27 17.46,86.68 17.46,80.01 | 17.46,80.01 v18.1,80.01 19.68,78.42 25.08,78.42 25.72,79.06 28.57,79.06 29.21,79.69 29.21,82.55 30.8,84.14 IC3.8 32.13,85.56 C5.1 | R45.2 5.5,42.55 5.08,42.55 4.76,42.86 4.76,46.04 6.35,47.62 12.06,47.62 v13.34,48.9 | v17.14,48.9 16.83,48.58 | C24.1 31.75,45.3 | C24.1 32.13,44.92 | 5.93,82.23 6.03,82.23 R20.1 | v11.43,80.01 R10.2 | v11.75,39.05 R46.2 | C39.+ 31.11,25.08 30.48,25.72 20.64,25.72 15.56,30.8 15.56,38.73 v15.24,39.05
  Top 0.356: v55.88,83.82 53.02,83.82 51.85,82.65 C7.1 | 52.07,42.23 52.07,42.01
  Top 0.406: C36.1 v36.2,23.18 36.02,23.36 C39.+ 29.7,23.36 28.57,22.23 24.13,22.23 23.5,22.86 23.5,24.08 IC14.2 | v41.27,23.18 42.55,21.91 47.31,21.91 48.26,22.86 50.8,22.86 | 50.8,22.86 J20.2 | 59.69,80.01 v59.69,54.61 59.69,46.67 60.33,46.04 v60.33,44.13 60.33,40.01 60.96,39.37 60.96,38.42 | 59.69,80.01 v59.69,83.82 59.69,89.22 60.64,90.17 62.23,90.17 63.5,91.44 63.5,95.25 61.59,97.16 SW1.O | C7.1 IC4.8 | IC12.8 C27.1 51.85,42.01 52.07,42.23 53.02,43.18 v53.98,43.18 | 50.8,22.86 50.8,21.27 L1.1 | v67.31,55.24 66.14,55.24 C21.1 IC8.5 | IC6.5 68.29,73.53 C14.1 68.16,73.76 67.31,74.61 67.31,76.83 67.63,77.15 IC5.5 68.29,78.61 C13.1 68.26,78.84 68.26,79.06 67.31,80.01 59.69,80.01 | C45.1 68.48,3.17 | C37.1 v76.2,22.54 75.56,21.91 75.56,15.03 C41.1 75.56,14.82 75.56,14.29 74.31,13.03 IC16.19 71.51,13.02 | IC16.9 68.12,3.53 C45.1 | 59.37,19.68 C40.1 61.28,19.47 61.28,19.05 61.91,18.41 63.18,18.41 63.32,18.27 IC16.31 | v69.22,7.94 59.37,17.78 59.37,19.68 | 83.5,4.45 v83.5,15.24 | 83.5,4.45 81.6,2.54 v70.17,2.54 69.53,2.54 68.68,3.39 C45.1 | 83.5,4.45 v83.5,2.86 | IC13.16 64.45,32.38 63.6,33.23 C34.1 C33.1 v60.96,35.24 60.96,38.42 | v59.37,20.95 59.37,19.68 | 60.96,38.42 R62.1
  Bottom 0.254: v18.1,80.01 v11.43,80.01 | v13.34,48.9 v17.14,48.9 | v19.05,39.05 v15.24,39.05 v11.75,39.05 | v59.37,20.95 58.1,22.23 55.88,22.23 55.24,22.86 55.24,24.77 J20.2
  Bottom 0.356: v59.69,83.82 v55.88,83.82 | v60.33,44.13 59.37,43.18 v53.98,43.18
  Bottom 0.406: v36.2,23.18 v41.27,23.18 | v67.31,55.24 64.45,55.24 63.82,54.61 v59.69,54.61 | v83.5,15.24 v76.2,22.54 | v70.17,2.54 70.17,6.99 v69.22,7.94 | v83.5,2.86 J18.1 | v60.96,35.24 53.98,28.26 J20.2
ADC_MISO
  Top 0.254: IC16.26 67.32,20.31 65.72,21.91 63.82,21.91 63.18,22.54 63.18,26.35 64.14,27.3 IC13.12
ADC_MOSI
  Top 0.254: IC16.25 68.12,20.46 66.04,22.54 64.14,22.54 63.82,22.86 63.82,25.72 64.14,26.04 IC13.11
ADC_SCK
  Top 0.254: IC16.27 66.52,20.16 65.41,21.27 63.5,21.27 62.55,22.23 62.55,27.3 63.82,28.57 IC13.13
ADC_SS
  Top 0.254: IC13.10 67.63,24.77 69.72,22.67 IC16.23
AREF
  Top 0.254: IC11.1 64.13,39.69 65.09,38.73 65.09,38.63 R62.2 C32.1 66.36,37.15 67.63,35.88 67.63,31.43 67.31,31.11 IC13.15
AREF_-10  (via drill 0.6)
  Top 0.254: v38.73,78.42 39.95,78.42 R27.1 | v55.56,77.47 54.35,77.47 R28.1 | v54.61,73.03 54.61,71.12 53.34,69.85 v44.77,69.85 | v46.99,35.56 46.99,34.29 51.44,29.84 53.02,29.84 54.93,31.75 54.93,36.51 54.61,36.83 R65.1 | v20.32,80.33 20.32,80.01 20.95,79.38 R25.1 | v20.32,77.47 20.64,77.79 R26.1 27.09,77.05 27.3,76.83 v30.48,76.83 | v38.73,37.78 R64.1 | R61.1 22.64,38.31 22.23,38.73 v21.27,38.73 | v31.43,36.83 30.8,36.2 27.3,36.2 26.99,36.51 26.99,37.05 R63.1 21.91,37.15 v21.59,36.83
  Top 0.406: R68.P$3 44.77,24.79 44.77,30.48 45.09,30.8 v45.09,35.56 | v44.77,48.9 44.77,64.45 44.81,64.49 R31.P$3 | R3.2 C2.1 54.3,97.06 IC1.2 49.99,95.4 v44.77,90.17
  Bottom 0.254: 44.77,78.42 v38.73,78.42 32.07,78.42 v30.48,76.83 | v55.56,77.47 54.61,76.52 v54.61,73.03 | 45.09,37.78 v38.73,37.78 32.38,37.78 v31.43,36.83 | v45.09,35.56 v46.99,35.56 | v20.32,77.47 20.64,77.79 20.64,80.01 v20.32,80.33 | v21.27,38.73 21.59,38.42 v21.59,36.83
  Bottom 0.406: v44.77,48.9 44.77,45.11 R41.P$3 45.09,44.79 45.09,37.78 v45.09,35.56 | R31.P$3 44.81,66 44.77,66.04 v44.77,69.85 44.77,78.42 44.77,84.77 44.81,84.81 R4.P$3 44.77,85.75 v44.77,90.17
CH1
  Top 0.254: R8.2 C4.2 22.64,86.14 23.18,86.68 26.67,86.68 | IC3.1 26.67,84.39 26.67,86.68 | IC13.1 59.69,32.38 59.37,32.7 59.37,39.05 59.05,39.37 59.05,42.86 58.1,43.81 58.1,84.14 56.83,85.41 52.7,85.41 51.44,84.14 41.27,84.14 37.15,88.27 28.26,88.27 26.67,86.68
CH2
  Top 0.254: IC13.2 59.05,31.11 58.74,31.43 58.74,38.73 58.42,39.05 58.42,42.55 57.47,43.5 57.47,83.82 56.52,84.77 53.02,84.77 51.75,83.5 37.47,83.5 37.15,83.19 R12.2 C6.2 36.41,85.51 36.2,85.72 33.97,85.72 33.66,85.41 33.66,83.19 33.34,82.87 IC3.7
CH3
  Top 0.254: 26.99,46.04 28.57,47.62 37.15,47.62 41.27,43.5 51.12,43.5 52.7,45.09 54.93,45.09 55.56,44.45 55.56,42.55 56.52,41.59 56.52,38.1 56.83,37.78 56.83,30.16 58.42,28.57 58.42,27.94 59.05,27.3 IC13.5 | R44.2 C23.2 22.64,45.82 22.86,46.04 26.99,46.04 | IC10.1 26.99,43.56 26.99,46.04
CH4
  Top 0.254: IC10.7 33.34,42.23 33.66,42.55 33.66,44.77 33.97,45.09 36.2,45.09 36.41,44.87 C26.2 R47.2 37.15,42.55 37.47,42.86 51.44,42.86 53.02,44.45 54.29,44.45 54.93,43.81 54.93,42.23 55.88,41.27 55.88,37.78 56.2,37.47 56.2,29.84 57.78,28.26 57.78,27.62 58.74,26.67 58.74,26.35 59.05,26.04 IC13.6
CH5
  Top 0.254: IC4.7 50.8,81.28 51.12,81.6 53.34,81.6 53.55,81.38 R23.2 C12.2 55.88,79.06 56.83,78.11 56.83,43.18 57.78,42.23 57.78,38.73 58.1,38.42 58.1,30.8 59.05,29.84 IC13.3
CH6
  Top 0.254: C10.2 R17.2 40.11,82.33 40.32,82.55 IC4.1 45.72,82.55 46.04,82.23 46.04,79.06 50.8,74.3 55.24,74.3 56.2,73.34 56.2,42.86 57.15,41.91 57.15,38.42 57.47,38.1 57.47,30.48 59.37,28.57 IC13.4
CH7
  Top 0.254: IC12.7 50.8,40.64 51.12,40.96 53.02,40.96 53.55,40.42 R58.2 C31.2 54.29,38.42 55.56,37.15 55.56,29.53 57.15,27.94 57.15,27.3 58.1,26.35 58.1,25.72 59.05,24.77 IC13.7
CH8  (via drill 0.6)
  Top 0.254: C29.2 R52.2 40.11,41.7 40.32,41.91 IC12.1 45.72,41.91 46.04,41.59 46.04,34.29 52.7,27.62 v55.56,27.62 | v57.78,24.77 58.42,24.13 58.42,23.81 58.74,23.5 IC13.8
  Bottom 0.254: v57.78,24.77 57.78,26.67 56.83,27.62 v55.56,27.62
CHANNEL1
  Top 0.254: IC5.4 68.9,75.25 69.22,75.56 69.22,79.69 67.94,80.96 64.14,80.96 63.17,81.93 C8.+
CHANNEL1_BUFFERED
  Top 0.254: R11.2 R6.2 69.53,84.56 69.53,93.98 72.71,97.16 J4.P3
CHANNEL1_RETURN
  Top 0.254: R5.P$2 88.9,84.45 90.17,83.19 91.12,83.19 92.71,81.6 92.71,79.06 91.12,77.47 91.12,71.44 93.34,69.22 93.34,60.96 91.54,59.16 R40.1
CHANNEL2
  Top 0.254: IC6.4 68.58,70.17 69.22,70.8 69.22,73.98 70.8,75.56 78.42,75.56 79.38,76.52 83.19,76.52 86.35,79.68 C9.+
CHANNEL2_BUFFERED  (via drill 0.6)
  Top 0.254: R7.2 R13.2 83.4,82.55 90.81,82.55 92.08,81.28 92.08,79.38 91.44,78.74 86.36,78.74 83.5,75.88 79.69,75.88 v78.42,74.61
  Bottom 0.254: v78.42,74.61 76.2,76.83 J8.P3
CHANNEL2_RETURN
  Top 0.254: R36.1 84.88,62.87 87.63,62.87 88.9,64.14 R32.P$2
CHANNEL3
  Top 0.254: IC8.4 68.55,53.69 69.22,53.02 69.22,49.53 67.63,47.94 C25.+
CHANNEL3_BUFFERED  (via drill 0.6)
  Top 0.254: R48.2 R43.2 71.75,44.35 v71.75,56.52
  Bottom 0.254: v71.75,56.52 J12.P3
CHANNEL3_RETURN
  Top 0.254: R42.P$2 88.9,51.75 87.31,53.34 87.31,57.47 86.36,58.42 R38.1
CHANNEL4
  Top 0.254: IC15.8 83.5,20.85 83.5,21.91 81.92,23.5 81.92,25.4 77.79,29.53 77.79,33.66 78.74,34.61 86.68,34.61 91.14,39.06 C28.+
CHANNEL4_BUFFERED
  Top 0.254: R54.2 R49.2 88.9,42.23 89.53,41.59 89.53,38.42 86.36,35.24 76.83,35.24 J16.P3
CHANNEL4_RETURN
  Top 0.254: R69.P$2 88.9,32.7 94.61,38.42 94.61,46.99 87.95,53.66 R39.1
COARSE1
  Top 0.254: R4.P$2 47.31,86.68 46.67,87.31 39.05,87.31 35.56,90.81 22.23,90.81 19.05,93.98 17.46,93.98 17.14,93.66 17.14,90.49 19.37,88.27 19.37,82.87 21.27,80.96 R19.1
COARSE2
  Top 0.254: R31.P$2 47.31,66.99 46.04,68.26 42.23,68.26 39.37,71.12 39.37,73.98 37.47,75.88 37.47,81.28 37.15,81.6 R16.1
COARSE3
  Top 0.254: R41.P$2 47.31,46.2 46.99,46.51 39.21,46.51 35.56,50.16 22.23,50.16 19.05,53.34 17.78,53.34 17.14,52.7 17.14,50.48 19.37,48.26 19.37,43.18 22.23,40.32 R55.1
COARSE4
  Top 0.254: R51.1 36.83,40.96 37.47,40.32 37.47,29.53 43.81,23.18 46.67,23.18 47.31,23.81 R68.P$2
CV1  (via drill 0.6)
  Top 0.254: R14.1 v21.27,82.55 20,83.82 20,88.58 18.41,90.17 J2.P3
  Bottom 0.254: J6.P2 26.04,78.42 21.91,82.55 v21.27,82.55
CV2
  Top 0.254: R24.1 36.51,79.91 36.51,76.2 35.24,74.93 33.34,74.93 28.57,70.17 26.04,70.17 | 26.04,70.17 20.64,70.17 J6.P3 | J10.P2 26.04,70.17
CV3  (via drill 0.6)
  Top 0.254: R50.1 21.91,41.91 v21.27,42.55 20,43.81 20,48.58 18.41,50.16 J10.P3
  Bottom 0.254: J14.P2 26.04,37.78 v21.27,42.55
CV4  (via drill 0.6)
  Top 0.254: R59.1 36.51,39.37 36.51,38.73 35.56,37.78 33.97,37.78 31.43,35.24 20,35.24 19.05,36.2 v19.05,36.51
  Bottom 0.254: v19.05,36.51 18.41,35.88 J14.P3
DAC_MOSI
  Top 0.254: IC16.17 76.83,11.43 78.74,13.34 78.74,16.51 78.42,16.83 IC15.4
DAC_SCK
  Top 0.254: 71.53,9.84 IC16.15 73.01,9.83 73.34,10.16 77.47,10.16 80.01,12.7 80.01,17.46 79.38,18.1 IC15.3 77.15,18.1
DAC_SS
  Top 0.203: 79.06,17.46 76.2,17.46
  Top 0.229: 79.38,17.14 79.06,17.46 | 76.2,17.46 76.2,19.37
  Top 0.254: 79.38,17.14 79.38,13.02 77.15,10.79 73.03,10.79 72.86,10.63 IC16.16 | 76.2,19.37 IC15.2
FM1  (via drill 0.6)
  Top 0.254: v48.26,88.27 47.94,87.95 39.37,87.95 36.51,90.81 36.51,96.2 35.56,97.16 J3.P3 | v47.31,81.28 47.31,78.74 51.12,74.93 53.66,74.93 54.19,75.46 R30.1
  Bottom 0.254: v47.31,81.28 49.85,83.82 50.8,83.82 51.44,84.45 51.44,86.68 49.85,88.27 v48.26,88.27
FM2  (via drill 0.6)
  Top 0.254: v38.73,76.83 R29.1
  Bottom 0.254: J7.P3 v38.73,76.83
FM3  (via drill 0.6)
  Top 0.254: R67.1 53.55,33.66 50.8,33.66 47.31,37.15 v47.31,40.64 | v48.26,47.62 47.94,47.31 43.5,47.31 J11.P3
  Bottom 0.254: v47.31,40.64 49.85,43.18 50.48,43.18 51.44,44.13 51.44,46.04 49.85,47.62 v48.26,47.62
FM4  (via drill 0.6)
  Top 0.254: v38.73,36.2 R66.1
  Bottom 0.254: J15.P3 v38.73,36.2
GATE1
  Top 0.254: IC16.40 58.57,10.63 55.88,7.94 48.26,7.94 47.31,8.89 47.31,17.78 44.77,20.32 41.91,20.32 39.05,23.18 39.05,25.72 34.92,29.84 21.59,29.84 20.32,31.11 20.32,32.7 18.1,34.92 18.1,46.35 15.56,48.9 15.56,69.85 15.88,70.17 15.88,75.88 16.83,76.83 16.83,84.77 15.56,86.04 11.75,86.04 10.79,85.09 8.74,85.09 Q1.C 8.4,85.09 6.35,85.09 6.03,84.77 R9.1
GATE1_IN
  Top 0.254: R21.2 7.62,78.42 7.3,78.11 3.81,78.11 | 3.81,78.11 3.81,94.3 6.67,97.16 J1.P3 | 3.81,78.11 3.81,73.34 7.94,69.22 J5.P2
GATE1_LED
  Top 0.254: LED4.A 43.4,16.09 R74.2
GATE2
  Top 0.254: IC16.41 58.73,9.83 56.2,7.3 47.94,7.3 46.67,8.57 46.67,17.46 44.45,19.68 41.59,19.68 38.42,22.86 38.42,24.77 35.88,27.3 33.66,27.3 33.34,27.62 21.59,27.62 19.68,29.53 19.68,32.38 17.46,34.61 17.46,46.04 14.92,48.58 14.92,70.17 15.24,70.48 15.24,76.2 16.19,77.15 16.19,84.45 15.73,84.92 Q2.C 13.8,85.09 11.75,85.09 11.43,84.77 R10.1
GATE2_IN
  Top 0.254: 13.02,76.83 13.02,67.63 9.84,64.45 9.84,59.05 12.06,56.83 12.06,51.44 9.84,49.21 J9.P2 | 13.02,76.83 R22.2 | 13.02,76.83 J5.P3
GATE2_LED
  Top 0.254: LED3.A 35.14,16.09 R73.2
GATE3
  Top 0.254: 59.78,8.89 IC16.42 58.88,9.03 56.52,6.67 47.62,6.67 46.04,8.26 46.04,17.14 44.13,19.05 41.27,19.05 37.78,22.54 37.78,23.81 36.83,24.77 33.34,24.77 31.11,26.99 21.27,26.99 16.83,31.43 16.83,45.4 16.19,46.04 11.75,46.04 10.62,44.91 Q3.C 8.09,45.09 6.03,45.09 5.71,44.77 R45.1
GATE3_IN
  Top 0.254: J13.P2 8.57,28.57 7.3,29.84 R56.2 7.2,39.05 6.67,39.05 4.13,41.59 4.13,51.75 8.89,56.52 J9.P3
GATE3_LED
  Top 0.254: LED2.A 26.89,16.09 R72.2
GATE4
  Top 0.254: IC16.43 59.03,8.23 56.83,6.03 47.31,6.03 45.4,7.94 45.4,16.83 43.81,18.41 40.96,18.41 37.15,22.23 37.15,23.5 36.51,24.13 33.02,24.13 30.8,26.35 20.95,26.35 16.19,31.11 16.19,44.45 15.73,44.91 Q4.C 14.12,45.09 12.06,45.09 11.75,44.77 R46.1
GATE4_IN
  Top 0.254: J13.P3 11.43,36.2 13.34,38.1 R57.2
GATE4_LED
  Top 0.254: LED1.A 18.63,16.09 R71.2
GND  (via drill 0.6)
  Top 0.406: 54.61,40.85 54.61,40.64
  other vias: 58.1,12.38 64.45,19.37 76.83,13.34 66.67,1.59 15.24,40.96 28.57,86.68 28.73,46.2 43.18,76.2 30.16,40.64 43.81,36.83 50.48,77.15 50.16,36.83 56.2,81.92 60.33,22.23 50.8,12.7 7.62,62.23 12.06,62.23 62.23,36.51 75.88,24.45 62.23,43.18 67.15,49.21 67.63,57.15 65.72,68.58 64.77,73.66 65.09,78.74 76.2,82.87 76.2,60.64 78.11,42.55 78.74,37.78 83.19,67.31 83.19,87 85.72,19.68 63.82,9.53 66.36,8.26 67.63,13.34 29.84,15.88 38.73,16.51 13.97,16.51 17.46,19.05 33.66,19.05 27.94,24.13 83.82,45.72 91.44,62.23 1.27,101.6 1.27,1.27 1.27,91.44 1.27,71.12 1.27,50.8 1.27,40.64 1.27,30.48 1.27,10.16 21.59,1.27 71.44,1.27 96.52,1.27 96.52,10.16 96.52,20.32 96.52,30.48 96.52,40.64 96.52,50.8 96.52,60.96 96.52,71.12 96.52,81.28 96.52,91.44 96.52,101.6 85.09,101.6 74.93,101.6 18.1,96.2 57.78,94.61 88.9,97.79 38.1,59.69 38.1,69.85 88.9,19.05 88.9,90.17 66.04,90.17 40.64,90.17 48.9,20.95 53.34,64.77 53.34,54.61 64.14,29.84 71.75,6.03 76.2,64.14 14.92,80.96 8.89,40.96 1.27,60.96 31.11,52.7 78.11,59.05 78.11,79.38 72.07,67.94 74.61,67.94 72.07,77.15 65.09,14.61 7.62,73.66 4.76,33.02 67.94,22.23 54.93,40.64 49.53,90.17 30.16,80.96 46.04,76.2 14.61,78.11 21.11,87.47 20.95,47.15 41.91,85.72 41.91,45.09
  pour Bottom: 0,102.87 0,0 97.79,0 97.79,102.87
  pour Top (isolate 0.203): 0,102.87 0,0 97.79,0 97.79,102.87
MIDI_IN
  Top 0.254: IC16.12 74.17,7.43 75.25,6.35 77.47,6.35 J18.3
MIX  (via drill 0.6)
  Top 0.254: v95.25,66.67 95.25,30.48 93.34,28.57 93.34,6.99 J17.P3 | v88.9,69.22 80.96,69.22 76.83,65.09 73.34,65.09 72.07,66.36 69.85,66.36 69.53,66.04 69.53,65.62 R33.2 68.58,65.41 68.26,65.09 68.26,62.55 68.58,62.23 R34.2
  Bottom 0.254: v95.25,66.67 92.71,69.22 v88.9,69.22
N$1
  Top 0.254: 7.62,80.75 R21.1 Q1.B
N$2
  Top 0.254: Q2.B R22.1 13.02,80.75
N$3
  Top 0.254: 7.3,40.74 R56.1 Q3.B
N$4
  Top 0.254: R32.P$1 91.4,69.57 85.72,75.25 80.64,75.25 79.06,73.66 79.06,72.71 79.06,72.52 79.06,72.39 J8.P2
N$5
  Top 0.254: IC16.44 59.18,7.43 57.15,5.4 46.99,5.4 44.77,7.62 44.77,13.02 44.45,13.34 R74.1
N$6
  Top 0.254: R73.1 36.2,13.65 36.51,13.34 39.69,13.34 41.27,11.75 41.27,7.62 41.91,6.99 44.45,6.99 46.67,4.76 60.64,4.76 61.51,5.63 IC16.1
N$7
  Top 0.254: R72.1 27.94,13.65 28.89,12.7 39.37,12.7 40.64,11.43 40.64,6.99 41.27,6.35 44.13,6.35 46.35,4.13 60.96,4.13 | 60.96,4.13 60.98,4.1 | 60.96,4.13 61.91,4.13 62.52,4.74 IC16.2
N$8
  Top 0.254: R71.1 19.68,13.65 21.27,12.06 39.05,12.06 40.01,11.11 40.01,6.67 40.96,5.71 43.81,5.71 46.04,3.49 62.23,3.49 63.32,4.58 IC16.3
N$9
  Top 0.254: R50.2 R55.2 R61.2 | R50.2 R44.1 C23.1 | IC10.2 25.72,42.23 25.4,41.91 R50.2
N$11
  Top 0.254: IC4.2 42.86,81.28 42.55,81.6 R17.1 C10.1 R27.2 R29.2
N$12
  Top 0.254: R20.2 5.93,79.06 5.4,79.06 4.45,80.01 4.45,87.95 6.03,89.53 J1.P2
N$13
  Top 0.254: R51.2 R47.1 C26.1 | R51.2 R59.2 34.71,38.84 34.29,38.42 31.11,38.42 29.84,37.15 R63.2 | R51.2 IC10.6
N$15
  Top 0.254: IC12.6 50.8,39.37 51.44,40.01 R58.1 C31.1 51.85,38 52.39,37.47 52.39,36.93 R65.2 52.39,36.73 52.39,36.2 53.12,35.46 R67.2
N$18
  Top 0.254: IC12.2 42.86,40.64 42.55,40.96 R52.1 C29.1 R64.2 R66.2
N$19
  Top 0.254: 71.66,8.89 IC16.14 73.17,9.03 73.66,9.53 77.79,9.53 80.64,12.38 80.64,24.77 78.11,27.3 71.75,27.3 68.9,30.16 68.9,37.47 65.41,40.96 65.41,43.5 64.45,44.45 64.45,71.44 65.08,72.07 IC6.1
N$20
  Top 0.254: R15.1 69.22,81.28 67.94,82.55 C8.-
N$21  (via drill 0.6)
  Top 0.254: v66.99,52.39 IC8.2
  Bottom 0.254: v66.99,52.39 61.91,52.39 SW3.P
N$22
  Top 0.254: R15.2 R11.1 72.07,82.87 72.71,83.5 IC2.2
N$23
  Top 0.254: R6.1 71.65,84.77 IC2.1
N$24  (via drill 0.6)
  Top 0.254: v66.99,71.12 IC6.2
  Bottom 0.254: v66.99,71.12 62.87,71.12 SW2.P
N$25
  Top 0.254: R18.1 83.19,80.64 84.45,81.92 89.22,81.92 89.55,81.58 C9.-
N$26
  Top 0.254: R18.2 R13.1 IC2.6
N$27
  Top 0.254: IC2.7 80.01,83.5 80.33,83.82 R7.1
N$28
  Top 0.254: R53.1 68.58,40.96 67.63,41.91 C25.-
N$29
  Top 0.254: IC4.6 50.8,80.01 51.44,80.64 R23.1 C12.1 51.85,78.64 52.39,78.11 52.39,77.73 R28.2 R30.2
N$30
  Top 0.254: R53.2 R48.1 73.56,42.86 73.98,42.86 74.3,43.18 IC9.2
N$31
  Top 0.254: R43.1 73.56,44.45 IC9.1
N$32
  Top 0.254: R60.1 87.31,39.05 87.94,39.67 C28.-
N$33
  Top 0.254: R60.2 R54.1 81.7,41.91 IC9.6
N$34
  Top 0.254: R49.1 82.02,43.18 IC9.7
N$35
  Top 0.254: IC7.6 80.01,61.91 80.86,61.06 R35.1 C17.1 R36.2 84.98,60.86 R38.2 R39.2 R40.2
N$36
  Top 0.254: IC7.2 72.39,63.18 71.75,63.82 C16.1 R34.1 R37.2
N$37
  Top 0.254: IC7.1 72.39,64.45 71.44,65.41 R33.1 70.91,65.41 C16.2
N$38
  Top 0.406: D1.C 9.66,23.36 C38.+ 15.7,23.5 17.46,23.5 18.07,24.11 IC14.3
N$39  (via drill 0.6)
  Top 0.406: v55.56,10.16 55.98,10.58 C43.1 56.94,10.48 57.47,10.48 58.42,11.43 IC16.39 | v55.56,15.24 55.56,16.51 54.29,17.78 51.44,17.78 50.8,18.41 L1.2
  Bottom 0.406: v55.56,10.16 v55.56,15.24
N$40
  Top 0.254: R5.P$1 91.4,87.35 90.17,88.58 84.77,88.58 83.82,89.53 J4.P2
N$41
  Top 0.254: IC16.10 68.9,5.61 68.9,4.76 69.85,3.81 70.8,3.81 71.44,3.17 81.28,3.17 82.87,4.76 82.87,8.57 81.28,10.16 81.28,25.08 76.52,29.84 70.17,29.84 69.53,30.48 69.53,37.78 66.04,41.27 66.04,41.28 IC8.1
N$42
  Top 0.254: C17.2 R35.2 80.43,62.76 80.01,63.18 IC7.7 77.15,63.18 75.25,61.28 72.23,61.28 72.07,61.12 72.07,60.01 71.75,59.69 69.85,59.69 69.32,60.22 R37.1
N$43
  Top 0.254: R42.P$1 91.4,44.09 90.81,43.5 84.77,43.5 84.45,43.81 79.38,43.81 78.42,44.77 78.42,46.99 76.52,48.9 J12.P2
N$44  (via drill 0.6)
  Top 0.254: R69.P$1 91.4,23.45 90.81,22.86 83.5,22.86 82.55,23.81 82.55,25.72 79.69,28.57 v79.69,29.53
  Bottom 0.254: v79.69,29.53 78.74,28.57 J16.P2
N$45
  Top 0.254: R16.2 R12.1 C6.1 | R24.2 R16.2 | R24.2 34.71,80.11 | R16.2 IC3.6 | R26.2 29.53,77.79 30.48,78.74 34.29,78.74 34.71,79.16 R24.2
N$46
  Top 0.254: 15.72,98.9 R2.1 15.66,97.79 | R1.2 15.66,96.79 15.66,97.79 | 15.66,97.79 18.73,97.79 | 18.73,97.79 22.23,97.79 26.04,93.98 J2.P2 | C1.1 18.73,98.8 18.73,97.79
N$47
  Top 0.406: J19.1 J19.2 10.79,3.81 11.43,4.45 11.43,15.24 10.16,16.51 7.94,16.51 6.99,17.46 D2.A
N$48
  Top 0.254: 71.66,13.97 IC16.20 72.89,13.83 73.34,14.29 73.34,22.86 68.26,27.94 68.26,37.15 64.77,40.64 64.77,42.86 63.82,43.81 63.82,56.83 | 63.82,74.87 63.82,74.93 65.09,76.2 IC5.2 | 63.82,74.87 SW2.S | 63.82,56.83 63.82,74.87 | SW3.S 61.66,56.83 63.82,56.83
N$49
  Top 0.406: D3.C 4.45,15.88 6.35,13.97 J19.9 J19.10
N$50
  Top 0.254: C4.1 R8.1 R14.2 | R14.2 25.08,82.55 25.4,82.87 IC3.2 | R14.2 R19.2 R25.2
N$82
  Top 0.254: IC16.37 59.91,13.02 58.74,13.02 58.42,13.34 54.61,13.34 52.7,11.43 Q5.1 48.92,10.29 C44.2
N$83
  Top 0.254: IC16.36 58.88,13.83 58.74,13.97 53.98,13.97 52.83,15.11 Q5.2 52.68,15.14 C42.2
N$40000
  Top 0.254: 13.34,40.74 R57.1 Q4.B
NES_TRIANGLE_CLK  (via drill 0.6)
  Top 0.254: v68.9,11.43 68.92,11.46 IC16.24
  Bottom 0.254: J18.4 77.47,8.89 71.44,8.89 v68.9,11.43
PDICLK
  Top 0.254: 59.9,14.61 IC16.35 58.4,14.63 58.1,14.92 | J20.5 56.52,20.32 58.1,18.73 58.1,14.92 | R70.1 57.25,14.92 58.1,14.92
PDIDATA
  Top 0.254: 60.01,15.52 IC16.34 59.18,15.43 58.74,15.88 58.74,19.05 57.78,20 57.78,21.59 57.15,22.23 55.88,22.23 55.24,22.86 55.24,24.77 J20.1
SW1
  Top 0.254: IC16.4 64.12,4.43 62.55,2.86 45.72,2.86 43.5,5.08 39.69,5.08 38.38,3.77 SW7.1 SW7.2
SW2
  Top 0.254: IC16.5 64.92,4.28 62.87,2.22 31.43,2.22 30.12,3.53 SW6.1 SW6.2
SW3
  Top 0.254: IC16.6 65.72,4.13 63.18,1.59 23.81,1.59 21.87,3.53 SW5.1 SW5.2
SW4
  Top 0.254: IC16.7 66.52,3.98 63.5,0.95 23.5,0.95 22.23,2.22 14.92,2.22 13.65,3.49 13.61,3.49 SW4.1 SW4.2
SW_MIDI_LEARN
  Top 0.254: IC16.11 70.25,5.63 72.07,3.81 79.38,3.81 80.01,4.45 80.01,5.71 81.28,6.99 J18.2
SW_MIDI_MODE
  Top 0.254: IC16.13 75.59,8.23 J18.6
SYNC_SWITCH
  Top 0.254: IC16.28 65.72,20 65.09,20.64 63.18,20.64 61.91,21.91 61.91,33.02 61.59,33.34 60.33,33.34 60.01,33.66 60.01,39.37 59.69,39.69 59.69,43.18 58.74,44.13 58.74,89.85 SW1.P
VCC  (via drill 0.6)
  Top 0.254: 17.14,100.01 17.14,99.06 | 17.14,99.06 17.14,98.96 | R2.2 17.2,99.06 17.14,99.06
  Top 0.406: 3.17,64.77 3.17,60.96 3.49,60.64 3.49,23.18 4.45,22.22 D2.C 7.94,22.22 9.53,20.64 D1.A | 3.17,64.77 3.17,94.61 8.57,100.01 17.14,100.01 v80.64,100.01 | v80.64,87 81.38,86.26 C3.1 80.64,85.41 80.01,84.77 IC2.8 | v80.64,58.74 80.64,46.35 80.75,46.25 C22.1 80.75,44.49 IC9.8 | 6.53,64.63 C18.+ 5.89,64.77 3.17,64.77 | IC7.8 C15.1 81.38,66.25 v80.64,66.99
  Bottom 0.406: v80.64,58.74 v80.64,66.99 v80.64,87 v80.64,100.01
VEE  (via drill 0.6)
  Top 0.406: C19.- 13.2,59.69 v11.43,59.69 | 75.5,39.22 C30.2 | IC2.4 73.6,79.54 C11.2 v72.39,79.38 | 75.5,39.22 75.34,39.05 v74.3,39.05 | v72.07,58.74 73.34,58.74 | 73.34,58.74 73.34,46.2 v72.71,46.2 | 75.5,39.22 IC9.4 | IC7.4 73.6,59.22 C20.2 73.66,59.05 73.34,58.74 | v57.47,101.12 8.1,101.12 2.38,95.41 v2.38,59.69 2.38,21.75 3.18,20.95 D3.A | v57.47,98.74 R3.1 | v57.47,101.12 | v57.47,101.12 v73.34,101.12
  Bottom 0.406: v2.38,59.69 v11.43,59.69 | 73.34,79.38 v72.39,79.38 | v73.34,101.12 73.34,79.38 | v74.3,39.05 73.34,40.01 73.34,46.2 v72.71,46.2 | 73.34,79.38 73.34,60.01 v72.07,58.74 | v57.47,101.12 v57.47,98.74

### Text on the board
bPlace: PDI | Red stripe
tNames: Edges | cc-by-sa Émilie Gillet, 2014. v2
bNames: Edges | cc-by-sa Émilie Gillet, 2014. v2 | -12V | GND | GND | GND | +12V